# EAGLE design canSlaveV05b (EAGLE 6.5.0)

## Sheet 1 of 5
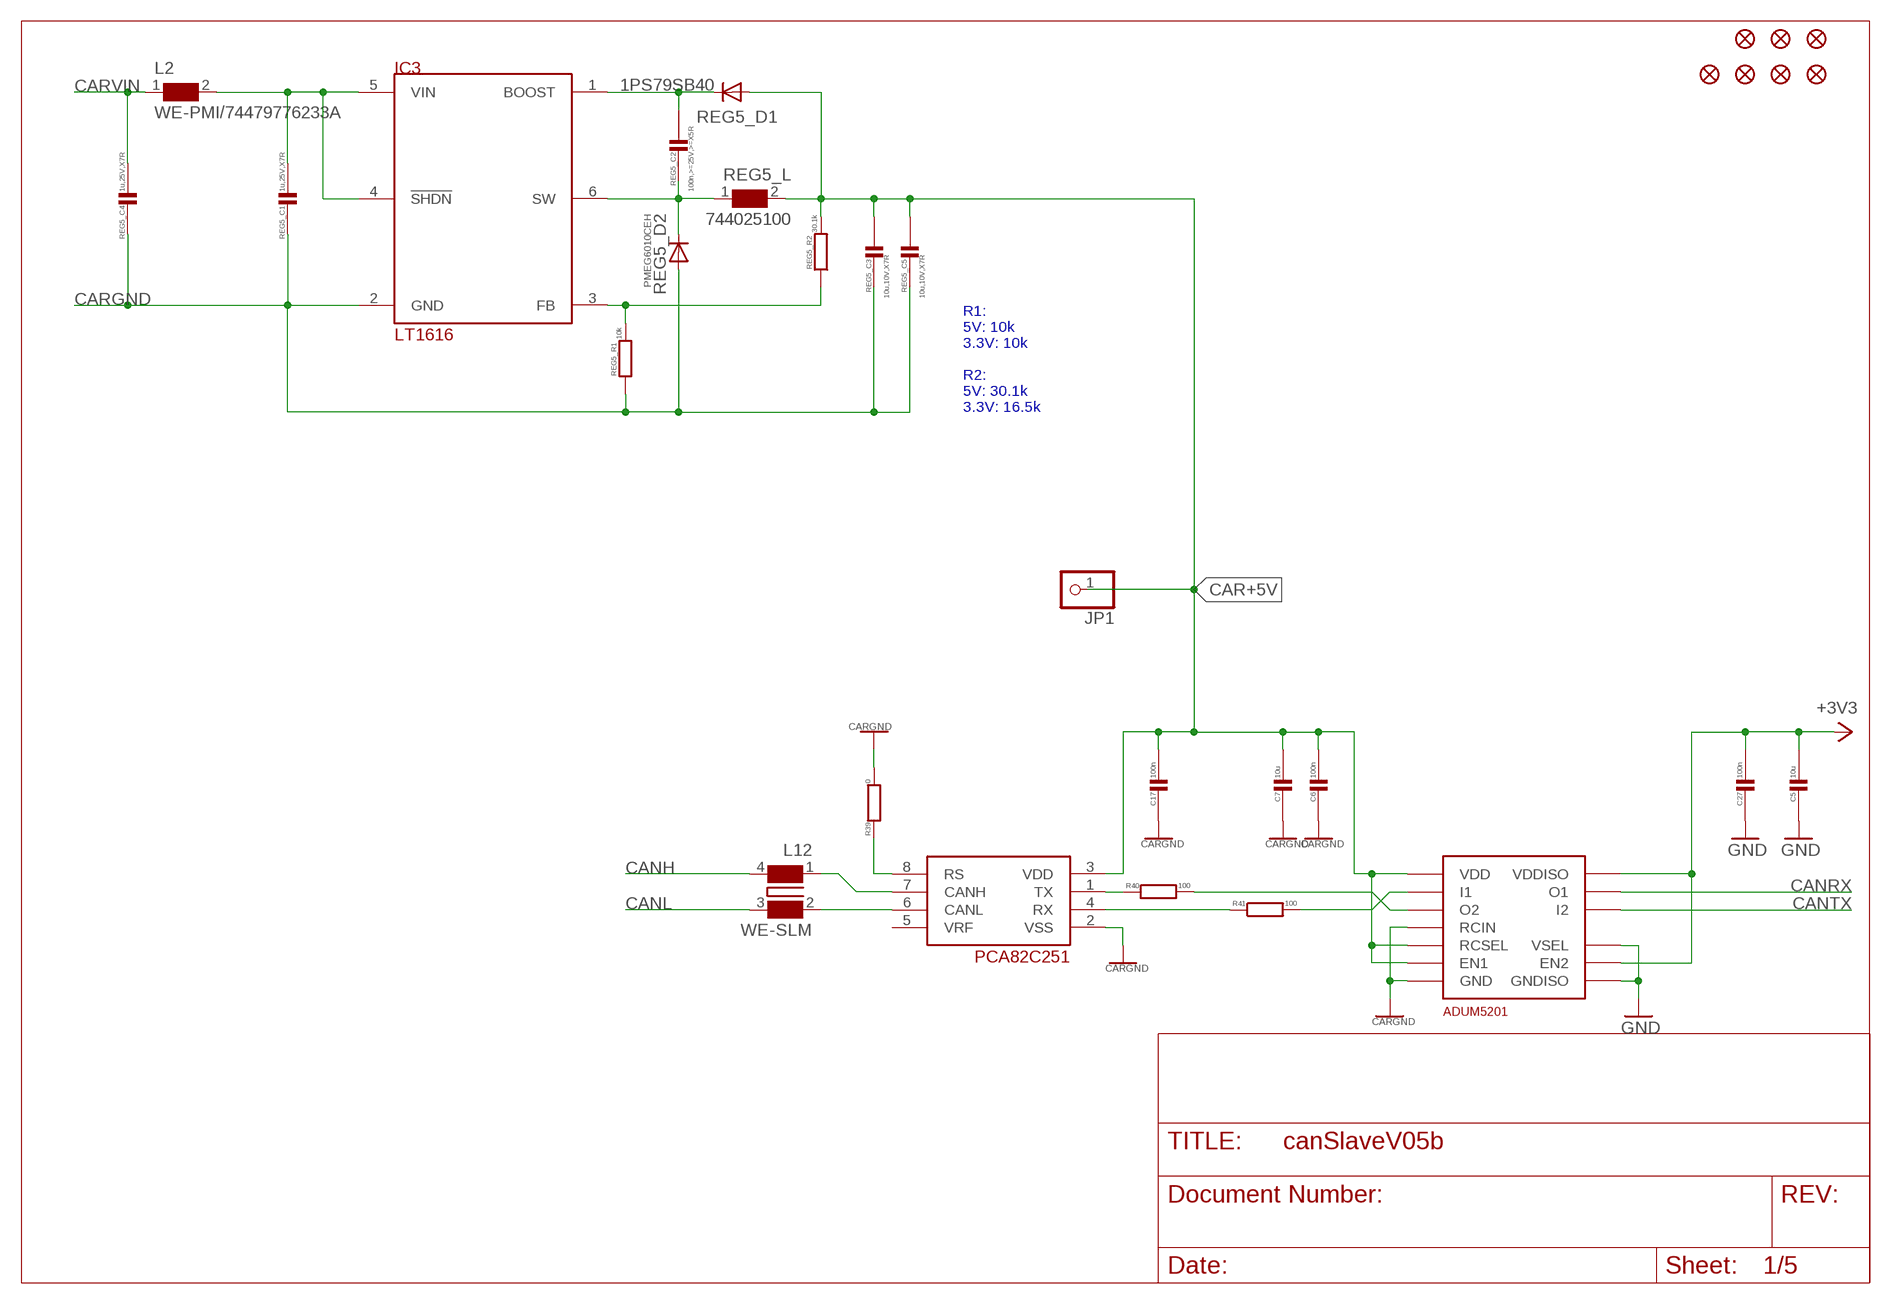
[diagram p0: schematic, sheet 1]

### Parts
C5  10u  C0603  [C0603]
C6  100n  C0402  [C0402]
C7  10u  C0603  [C0603]
C17  100n  C0402  [C0402]
C27  100n  C0402  [C0402]
FID2  FIDUCIAL""  [FIDUCIAL_1MM]
FID3  FIDUCIAL""  [FIDUCIAL_1MM]
FID4  FIDUCIAL""  [FIDUCIAL_1MM]
FID7  FIDUCIAL""  [FIDUCIAL_1MM]
FID8  FIDUCIAL""  [FIDUCIAL_1MM]
FID9  FIDUCIAL""  [FIDUCIAL_1MM]
FID10  FIDUCIAL""  [FIDUCIAL_1MM]
IC3  LT1616  [SOT23-6]
IC5  PCA82C251  MCP2551  [SO-8]
JP1  PINHD-1X1  [1X01]
L2  WE-PMI/74479776233A  WE-PMI_0806  [WE-PMI_0806]
L12  WE-SLM  [WE-SLM]
R39  0  R0402  [R0402]
R40  100  R0402  [R0402]
R41  100  R0402  [R0402]
REG5_C1  1u,25V,X7R  C0805  [C0805]
REG5_C2  100n,>=25V,>=X5R  C0402  [C0402]
REG5_C3  10u,10V,X7R  C0805  [C0805]
REG5_C4  1u,25V,X7R  C0805  [C0805]
REG5_C5  10u,10V,X7R  C0805  [C0805]
REG5_D1  1PS79SB40  DIODE-SOD523  [SOD523]
REG5_D2  PMEG6010CEH  D-SOD123  [SOD123]
REG5_L  744025100  WE-TPC_2828  [WE-TPC_2828]
REG5_R1  10k  R0402  [R0402]
REG5_R2  30.1k  R0402  [R0402]
U$2  ADUM5201  [SO16WB]

### Nets
+3V3: C5.1 C27.1 U$2.P$10(EN2) U$2.P$16(VDDISO) ; also sheet 2,3,5
BOOST1: IC3.1(BOOST) REG5_C2.1 REG5_D1.C
CANH: L12.4 ; also sheet 5
CANL: L12.3 ; also sheet 5
CANRX: U$2.P$14(O1) ; also sheet 2
CANTX: U$2.P$13(I2) ; also sheet 2
CAR+5V: C6.1 C7.1 C17.1 IC5.3(VDD) JP1.1 REG5_C3.1 REG5_C5.1 REG5_D1.A REG5_L.2 REG5_R2.2 U$2.P$1(VDD) U$2.P$6(RCSEL) U$2.P$7(EN1)
CAR_CANRX: R41.2 U$2.P$3(I1)
CAR_CANRX_T: IC5.4(RX) R41.1
CAR_CANTX: R40.2 U$2.P$4(O2)
CAR_CANTX_T: IC5.1(TX) R40.1
CARGND: C6.2 C7.2 C17.2 IC3.2(GND) IC5.2(VSS) R39.2 REG5_C1.2 REG5_C3.2 REG5_C4.2 REG5_C5.2 REG5_D2.2(A) REG5_R1.1 U$2.P$2(GND) U$2.P$5(RCIN) U$2.P$8(GND) ; also sheet 5
CARVIN: L2.1 REG5_C4.1 ; also sheet 5
CARVINFILT: IC3.4(!SHDN) IC3.5(VIN) L2.2 REG5_C1.1
FB1: IC3.3(FB) REG5_R1.2 REG5_R2.1
GND: C5.2 C27.2 U$2.P$9(GNDISO) U$2.P$11(VSEL) U$2.P$15(GNDISO) ; also sheet 2,3,5
N$2: IC5.7(CANH) L12.1
N$6: IC5.6(CANL) L12.2
RS1: IC5.8(RS) R39.1
SW1: IC3.6(SW) REG5_C2.2 REG5_D2.1(C) REG5_L.1
Unconnected: IC5.5(VRF)

### Notes on the sheet
- R1:
  5V: 10k
  3.3V: 10k
  
  R2:
  5V: 30.1k
  3.3V: 16.5k

## Sheet 2 of 5
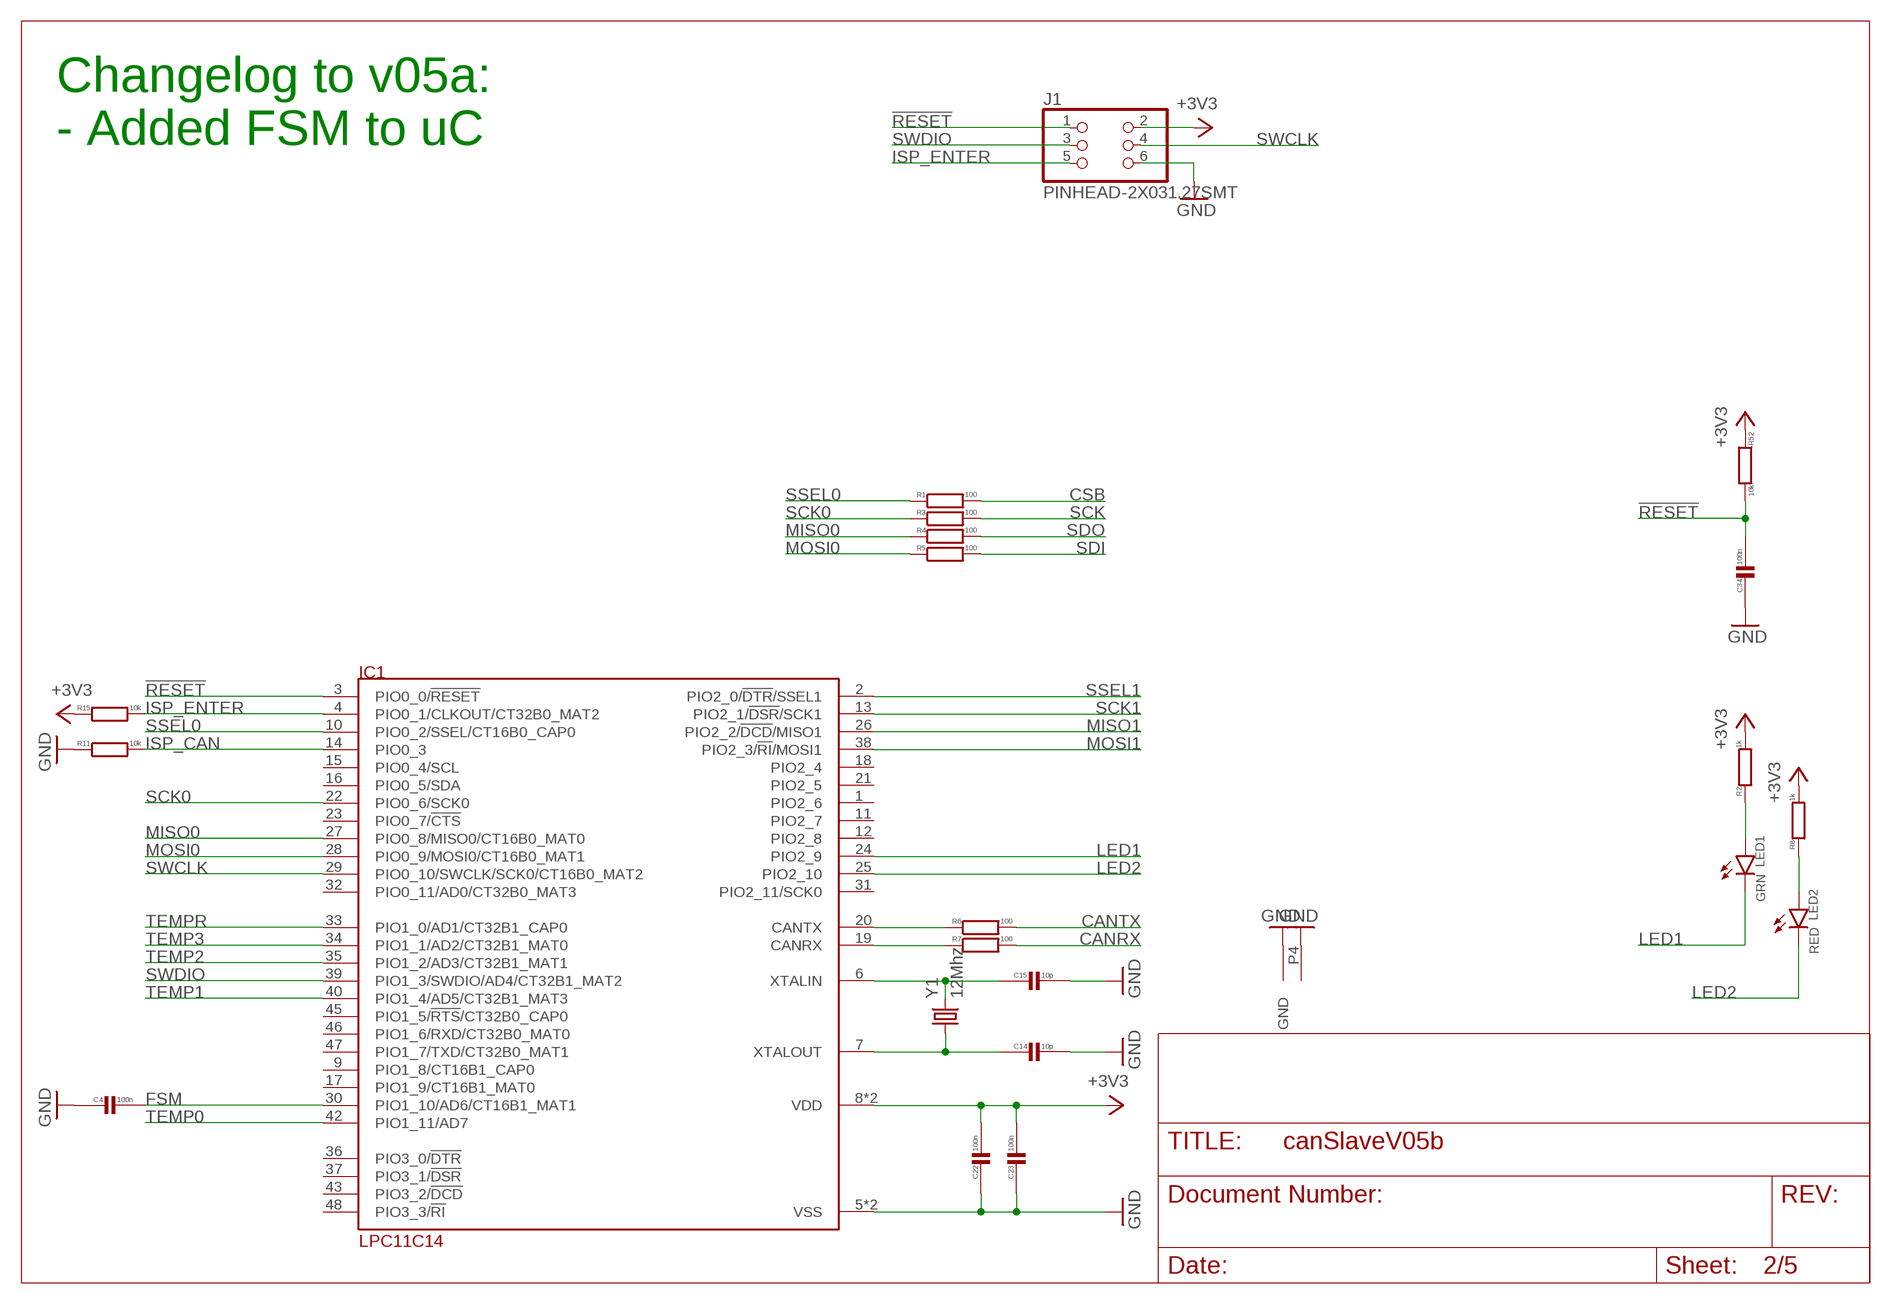
[diagram p1: schematic, sheet 2]

### Parts
C4  100n  C0402  [C0402]
C14  10p  C0402  [C0402]
C15  10p  C0402  [C0402]
C22  100n  C0402  [C0402]
C23  100n  C0402  [C0402]
C34  100n  C0402  [C0402]
IC1  LPC11C14  LPC11C1X  [LQFP48]
J1  PINHEAD-2X031.27SMT  [2X03_1.27MM_SMT]
LED1  GRN  LED0603  [CHIPLED_0603]
LED2  RED  LED0603  [CHIPLED_0603]
R1  100  R0402  [R0402]
R2  1k  R0402  [R0402]
R3  100  R0402  [R0402]
R4  100  R0402  [R0402]
R5  100  R0402  [R0402]
R6  100  R0402  [R0402]
R7  100  R0402  [R0402]
R8  1k  R0402  [R0402]
R11  10k  R0402  [R0402]
R15  10k  R0402  [R0402]
R52  10k  R0402  [R0402]
Y1  12Mhz  CRYSTAL43.2X2.5  [MT]

### Nets
!RESET: C34.1 IC1.3(PIO0_0/!RESET) J1.1 R52.2
+3V3: C22.1 C23.1 IC1.8(VDD) IC1.44(VDD) J1.2 R2.2 R8.2 R15.1 R52.1 ; also sheet 1,3,5
CANRX: R7.2 ; also sheet 1
CANRX_U_L: IC1.19(CANRX) R7.1
CANTX: R6.2 ; also sheet 1
CANTX_U_L: IC1.20(CANTX) R6.1
CSB: R1.2 ; also sheet 3
FSM: C4.1 IC1.30(PIO1_10/AD6/CT16B1_MAT1) ; also sheet 3
GND: C4.2 C14.1 C15.1 C22.2 C23.2 C34.2 IC1.5(VSS) IC1.41(VSS) J1.6 R11.1 Y1.P2(GND) Y1.P4(GND1) ; also sheet 1,3,5
ISP_CAN: IC1.14(PIO0_3) R11.2
ISP_ENTER: IC1.4(PIO0_1/CLKOUT/CT32B0_MAT2) J1.5 R15.2
LED1: IC1.24(PIO2_9) LED1.C
LED2: IC1.25(PIO2_10) LED2.C
MISO0: IC1.27(PIO0_8/MISO0/CT16B0_MAT0) R4.1
MISO1: IC1.26(PIO2_2/!DCD!/MISO1)
MOSI0: IC1.28(PIO0_9/MOSI0/CT16B0_MAT1) R5.1
MOSI1: IC1.38(PIO2_3/!RI!/MOSI1)
N$1: LED2.A R8.1
N$5: LED1.A R2.1
SCK: R3.2 ; also sheet 3
SCK0: IC1.22(PIO0_6/SCK0) R3.1
SCK1: IC1.13(PIO2_1/!DSR!/SCK1)
SDI: R5.2 ; also sheet 3
SDO: R4.2 ; also sheet 3
SSEL0: IC1.10(PIO0_2/SSEL/CT16B0_CAP0) R1.1
SSEL1: IC1.2(PIO2_0/!DTR!/SSEL1)
SWCLK: IC1.29(PIO0_10/SWCLK/SCK0/CT16B0_MAT2) J1.4
SWDIO: IC1.39(PIO1_3/SWDIO/AD4/CT32B1_MAT2) J1.3
TEMP0: IC1.42(PIO1_11/AD7) ; also sheet 5
TEMP1: IC1.40(PIO1_4/AD5/CT32B1_MAT3) ; also sheet 5
TEMP2: IC1.35(PIO1_2/AD3/CT32B1_MAT1) ; also sheet 5
TEMP3: IC1.34(PIO1_1/AD2/CT32B1_MAT0) ; also sheet 5
TEMPR: IC1.33(PIO1_0/AD1/CT32B1_CAP0) ; also sheet 3
XTALIN: C15.2 IC1.6(XTALIN) Y1.P3
XTALOUT: C14.2 IC1.7(XTALOUT) Y1.P1
Unconnected: IC1.1(PIO2_6) IC1.9(PIO1_8/CT16B1_CAP0) IC1.11(PIO2_7) IC1.12(PIO2_8) IC1.15(PIO0_4/SCL) IC1.16(PIO0_5/SDA) IC1.17(PIO1_9/CT16B1_MAT0) IC1.18(PIO2_4) IC1.21(PIO2_5) IC1.23(PIO0_7/!CTS) IC1.31(PIO2_11/SCK0) IC1.32(PIO0_11/AD0/CT32B0_MAT3) IC1.36(PIO3_0/!DTR) IC1.37(PIO3_1/!DSR) IC1.43(PIO3_2/!DCD) IC1.45(PIO1_5/!RTS!/CT32B0_CAP0) IC1.46(PIO1_6/RXD/CT32B0_MAT0) IC1.47(PIO1_7/TXD/CT32B0_MAT1) IC1.48(PIO3_3/!RI)

### Notes on the sheet
- Changelog to v05a:
  - Added FSM to uC

## Sheet 3 of 5
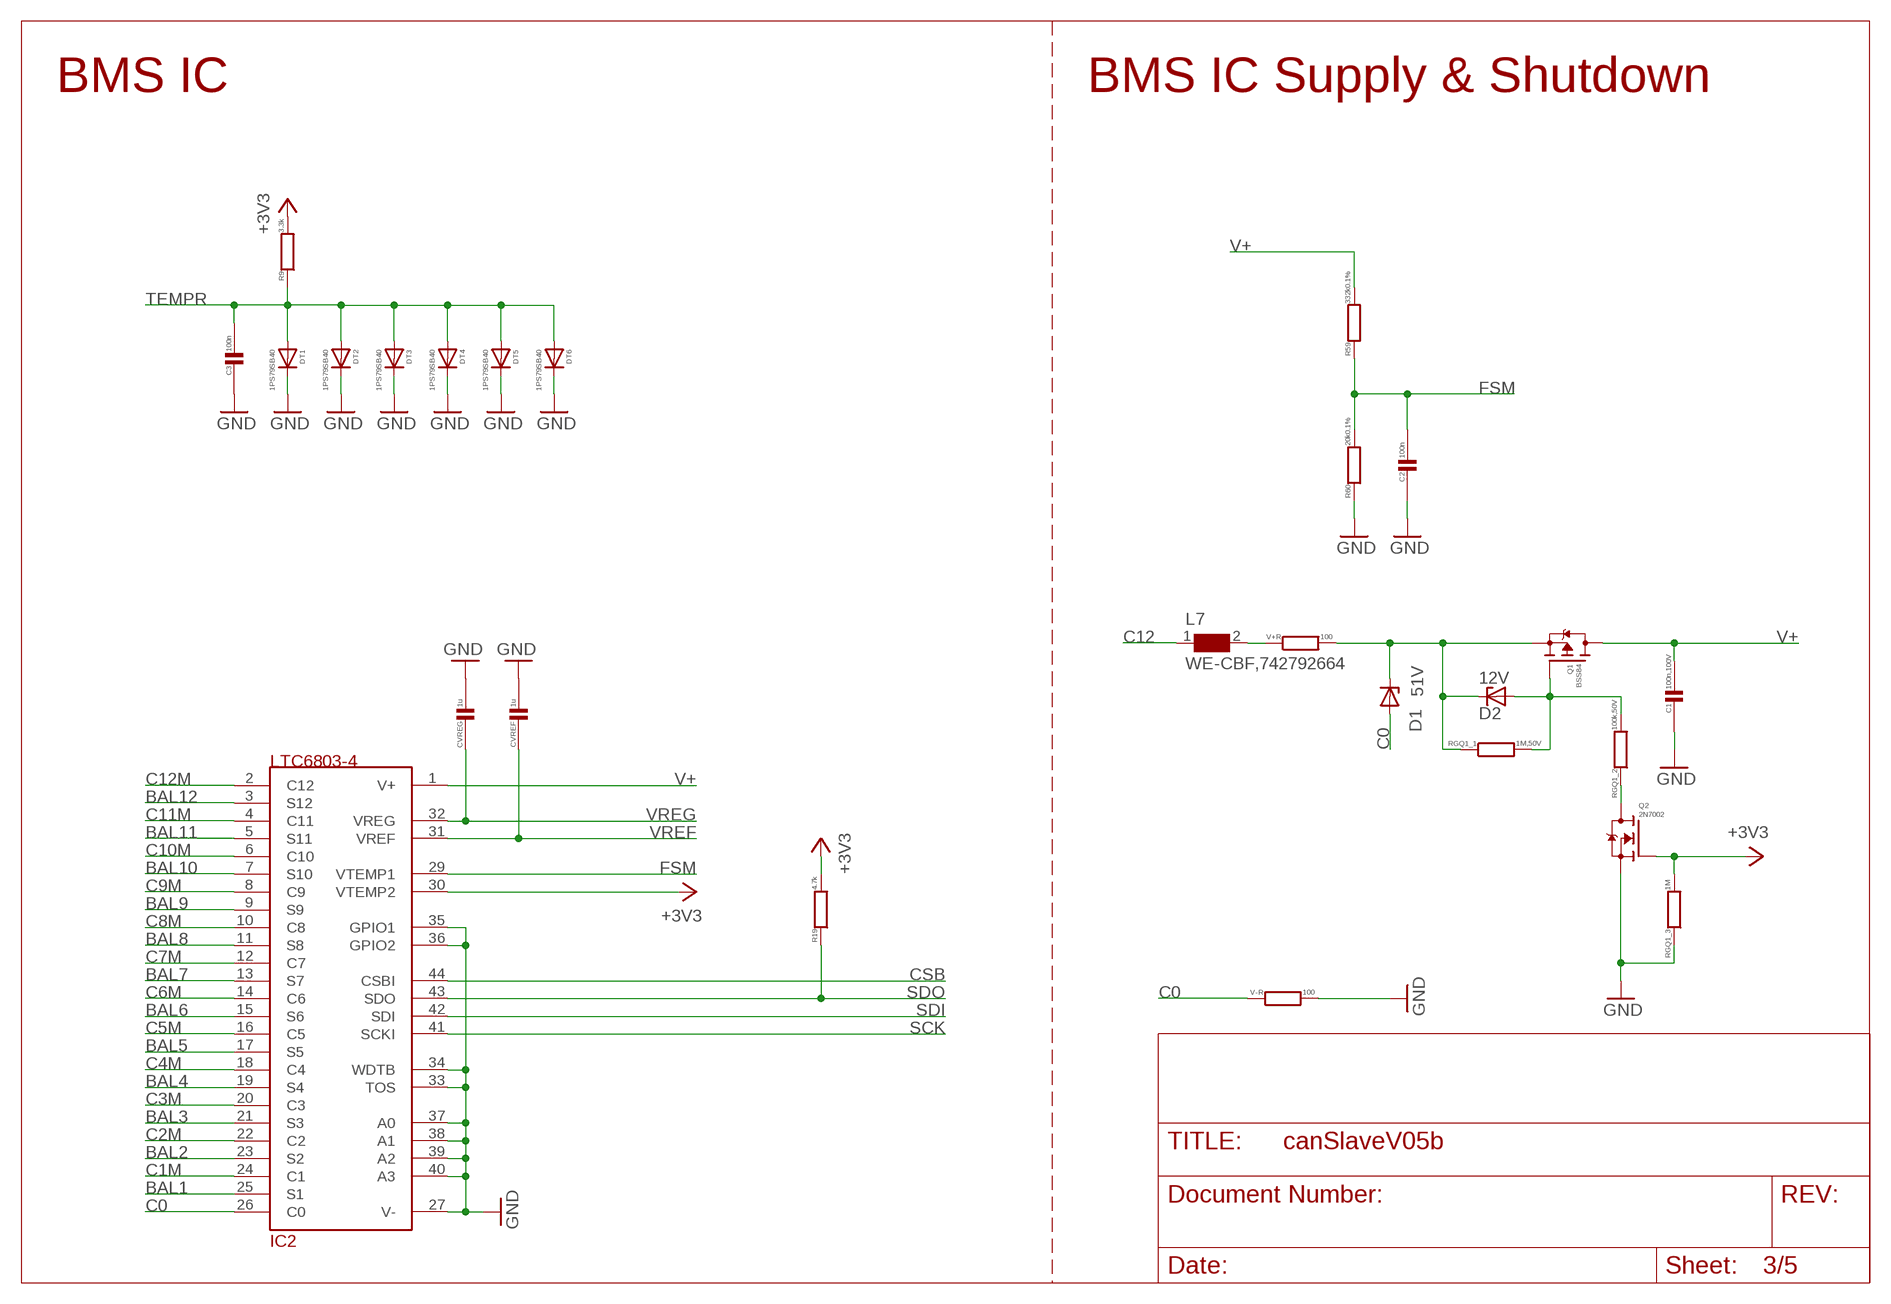
[diagram p2: schematic, sheet 3]

### Parts
C1  100n,100V  C0603  [C0603]
C2  100n  C0402  [C0402]
C3  100n  C0402  [C0402]
CVREF  1u  C0402  [C0402]
CVREG  1u  C0402  [C0402]
D1  51V  ZENERSOD323  [SOD323-L]
D2  12V  ZENERSOD323  [SOD323-L]
DT1  1PS79SB40  DIODE-SOD523  [SOD523]
DT2  1PS79SB40  DIODE-SOD523  [SOD523]
DT3  1PS79SB40  DIODE-SOD523  [SOD523]
DT4  1PS79SB40  DIODE-SOD523  [SOD523]
DT5  1PS79SB40  DIODE-SOD523  [SOD523]
DT6  1PS79SB40  DIODE-SOD523  [SOD523]
IC2  LTC6803-4  [44SSOP]
L7  WE-CBF,742792664  WE-CBF_0603  [0603]
Q1  BSS84  [SOT23]
Q2  2N7002  [SOT23]
R9  3.3k  R0603  [R0603]
R19  4.7k  R0402  [R0402]
R59  332k0.1%  R0603  [R0603]
R60  20k0.1%  R0402  [R0402]
RGQ1_1  1M,50V  R0603  [R0603]
RGQ1_2  100k,50V  R0603  [R0603]
RGQ1_3  1M  R0402  [R0402]
V+R  100  R0603  [R0603]
V-R  100  R0603  [R0603]

### Nets
+3V3: IC2.30(VTEMP2) Q2.1(G) R9.2 R19.2 RGQ1_3.2 ; also sheet 1,2,5
BAL1: IC2.25(S1) ; also sheet 4
BAL2: IC2.23(S2) ; also sheet 4
BAL3: IC2.21(S3) ; also sheet 4
BAL4: IC2.19(S4) ; also sheet 4
BAL5: IC2.17(S5) ; also sheet 4
BAL6: IC2.15(S6) ; also sheet 4
BAL7: IC2.13(S7) ; also sheet 4
BAL8: IC2.11(S8) ; also sheet 4
BAL9: IC2.9(S9) ; also sheet 4
BAL10: IC2.7(S10) ; also sheet 4
BAL11: IC2.5(S11) ; also sheet 4
BAL12: IC2.3(S12) ; also sheet 4
C0: D1.A IC2.26(C0) V-R.1 ; also sheet 4,5
C1M: IC2.24(C1) ; also sheet 4
C2M: IC2.22(C2) ; also sheet 4
C3M: IC2.20(C3) ; also sheet 4
C4M: IC2.18(C4) ; also sheet 4
C5M: IC2.16(C5) ; also sheet 4
C6M: IC2.14(C6) ; also sheet 4
C7M: IC2.12(C7) ; also sheet 4
C8M: IC2.10(C8) ; also sheet 4
C9M: IC2.8(C9) ; also sheet 4
C10M: IC2.6(C10) ; also sheet 4
C11M: IC2.4(C11) ; also sheet 4
C12: L7.1 ; also sheet 4,5
C12M: IC2.2(C12) ; also sheet 4
CSB: IC2.44(CSBI) ; also sheet 2
FSM: C2.1 IC2.29(VTEMP1) R59.1 R60.2 ; also sheet 2
GND: C1.2 C2.2 C3.2 CVREF.1 CVREG.1 DT1.C DT2.C DT3.C DT4.C DT5.C DT6.C IC2.27(V-) IC2.33(TOS) IC2.34(WDTB) IC2.35(GPIO1) IC2.36(GPIO2) IC2.37(A0) IC2.38(A1) IC2.39(A2) IC2.40(A3) Q2.2(S) R60.1 RGQ1_3.1 V-R.2 ; also sheet 1,2,5
N$3: Q2.3(D) RGQ1_2.1
N$4: L7.2 V+R.1
Q1G: D2.A Q1.1(G) RGQ1_1.2 RGQ1_2.2
SCK: IC2.41(SCKI) ; also sheet 2
SDI: IC2.42(SDI) ; also sheet 2
SDO: IC2.43(SDO) R19.1 ; also sheet 2
TEMPR: C3.1 DT1.A DT2.A DT3.A DT4.A DT5.A DT6.A R9.1 ; also sheet 2
V+: C1.1 IC2.1(V+) Q1.3(D) R59.2
V+S: D1.C D2.C Q1.2(S) RGQ1_1.1 V+R.2
VREF: CVREF.2 IC2.31(VREF)
VREG: CVREG.2 IC2.32(VREG)

### Notes on the sheet
- BMS IC | BMS IC Supply & Shutdown

## Sheet 4 of 5
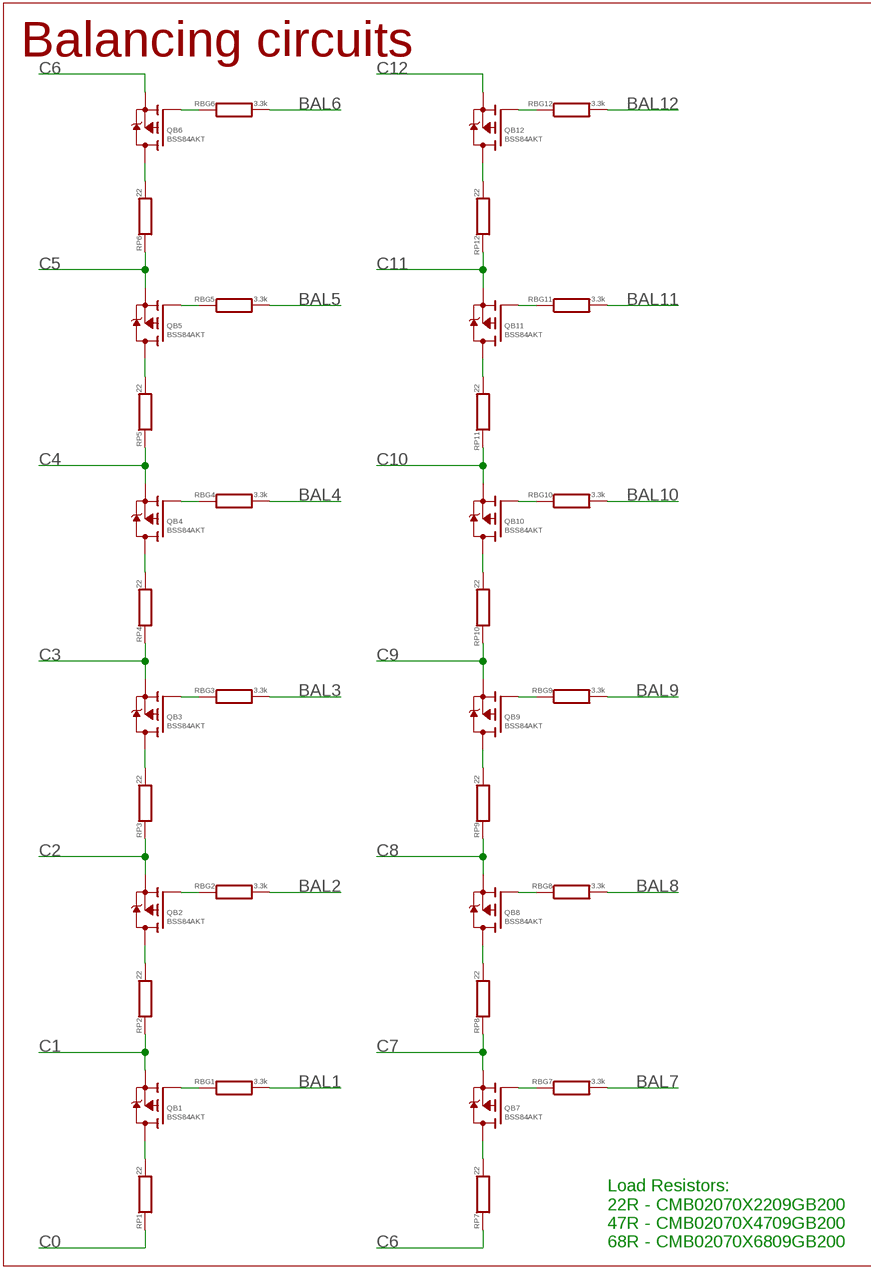
[diagram p3: schematic, sheet 4, part 1 of 2]
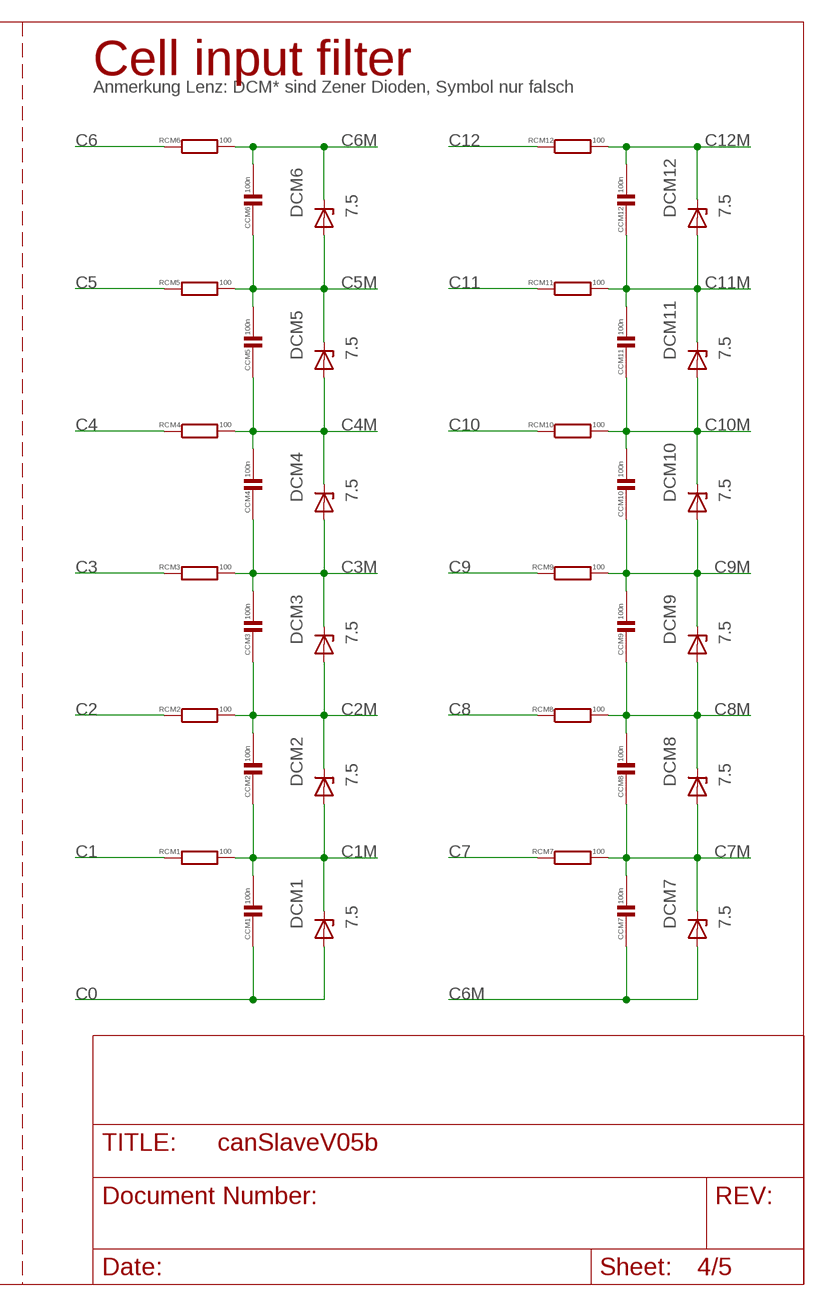
[diagram p4: schematic, sheet 4, part 2 of 2]

### Parts
CCM1  100n  C0402  [C0402]
CCM2  100n  C0402  [C0402]
CCM3  100n  C0402  [C0402]
CCM4  100n  C0402  [C0402]
CCM5  100n  C0402  [C0402]
CCM6  100n  C0402  [C0402]
CCM7  100n  C0402  [C0402]
CCM8  100n  C0402  [C0402]
CCM9  100n  C0402  [C0402]
CCM10  100n  C0402  [C0402]
CCM11  100n  C0402  [C0402]
CCM12  100n  C0402  [C0402]
DCM1  7.5  ZENERSOD523  [SOD523]
DCM2  7.5  ZENERSOD523  [SOD523]
DCM3  7.5  ZENERSOD523  [SOD523]
DCM4  7.5  ZENERSOD523  [SOD523]
DCM5  7.5  ZENERSOD523  [SOD523]
DCM6  7.5  ZENERSOD523  [SOD523]
DCM7  7.5  ZENERSOD523  [SOD523]
DCM8  7.5  ZENERSOD523  [SOD523]
DCM9  7.5  ZENERSOD523  [SOD523]
DCM10  7.5  ZENERSOD523  [SOD523]
DCM11  7.5  ZENERSOD523  [SOD523]
DCM12  7.5  ZENERSOD523  [SOD523]
QB1  BSS84AKT  [SOT416]
QB2  BSS84AKT  [SOT416]
QB3  BSS84AKT  [SOT416]
QB4  BSS84AKT  [SOT416]
QB5  BSS84AKT  [SOT416]
QB6  BSS84AKT  [SOT416]
QB7  BSS84AKT  [SOT416]
QB8  BSS84AKT  [SOT416]
QB9  BSS84AKT  [SOT416]
QB10  BSS84AKT  [SOT416]
QB11  BSS84AKT  [SOT416]
QB12  BSS84AKT  [SOT416]
RBG1  3.3k  R0402  [R0402]
RBG2  3.3k  R0402  [R0402]
RBG3  3.3k  R0402  [R0402]
RBG4  3.3k  R0402  [R0402]
RBG5  3.3k  R0402  [R0402]
RBG6  3.3k  R0402  [R0402]
RBG7  3.3k  R0402  [R0402]
RBG8  3.3k  R0402  [R0402]
RBG9  3.3k  R0402  [R0402]
RBG10  3.3k  R0402  [R0402]
RBG11  3.3k  R0402  [R0402]
RBG12  3.3k  R0402  [R0402]
RCM1  100  R0402  [R0402]
RCM2  100  R0402  [R0402]
RCM3  100  R0402  [R0402]
RCM4  100  R0402  [R0402]
RCM5  100  R0402  [R0402]
RCM6  100  R0402  [R0402]
RCM7  100  R0402  [R0402]
RCM8  100  R0402  [R0402]
RCM9  100  R0402  [R0402]
RCM10  100  R0402  [R0402]
RCM11  100  R0402  [R0402]
RCM12  100  R0402  [R0402]
RP1  22  RMELF-0207R  [MINI_MELF-0207R]
RP2  22  RMELF-0207R  [MINI_MELF-0207R]
RP3  22  RMELF-0207R  [MINI_MELF-0207R]
RP4  22  RMELF-0207R  [MINI_MELF-0207R]
RP5  22  RMELF-0207R  [MINI_MELF-0207R]
RP6  22  RMELF-0207R  [MINI_MELF-0207R]
RP7  22  RMELF-0207R  [MINI_MELF-0207R]
RP8  22  RMELF-0207R  [MINI_MELF-0207R]
RP9  22  RMELF-0207R  [MINI_MELF-0207R]
RP10  22  RMELF-0207R  [MINI_MELF-0207R]
RP11  22  RMELF-0207R  [MINI_MELF-0207R]
RP12  22  RMELF-0207R  [MINI_MELF-0207R]

### Nets
BAL1: RBG1.2 ; also sheet 3
BAL2: RBG2.2 ; also sheet 3
BAL3: RBG3.2 ; also sheet 3
BAL4: RBG4.2 ; also sheet 3
BAL5: RBG5.2 ; also sheet 3
BAL6: RBG6.2 ; also sheet 3
BAL7: RBG7.2 ; also sheet 3
BAL8: RBG8.2 ; also sheet 3
BAL9: RBG9.2 ; also sheet 3
BAL10: RBG10.2 ; also sheet 3
BAL11: RBG11.2 ; also sheet 3
BAL12: RBG12.2 ; also sheet 3
C0: CCM1.2 DCM1.A RP1.1 ; also sheet 3,5
C1: QB1.2(S) RCM1.1 RP2.1 ; also sheet 5
C1M: CCM1.1 CCM2.2 DCM1.C DCM2.A RCM1.2 ; also sheet 3
C2: QB2.2(S) RCM2.1 RP3.1 ; also sheet 5
C2M: CCM2.1 CCM3.2 DCM2.C DCM3.A RCM2.2 ; also sheet 3
C3: QB3.2(S) RCM3.1 RP4.1 ; also sheet 5
C3M: CCM3.1 CCM4.2 DCM3.C DCM4.A RCM3.2 ; also sheet 3
C4: QB4.2(S) RCM4.1 RP5.1 ; also sheet 5
C4M: CCM4.1 CCM5.2 DCM4.C DCM5.A RCM4.2 ; also sheet 3
C5: QB5.2(S) RCM5.1 RP6.1 ; also sheet 5
C5M: CCM5.1 CCM6.2 DCM5.C DCM6.A RCM5.2 ; also sheet 3
C6: QB6.2(S) RCM6.1 RP7.1 ; also sheet 5
C6M: CCM6.1 CCM7.2 DCM6.C DCM7.A RCM6.2 ; also sheet 3
C7: QB7.2(S) RCM7.1 RP8.1 ; also sheet 5
C7M: CCM7.1 CCM8.2 DCM7.C DCM8.A RCM7.2 ; also sheet 3
C8: QB8.2(S) RCM8.1 RP9.1 ; also sheet 5
C8M: CCM8.1 CCM9.2 DCM8.C DCM9.A RCM8.2 ; also sheet 3
C9: QB9.2(S) RCM9.1 RP10.1 ; also sheet 5
C9M: CCM9.1 CCM10.2 DCM9.C DCM10.A RCM9.2 ; also sheet 3
C10: QB10.2(S) RCM10.1 RP11.1 ; also sheet 5
C10M: CCM10.1 CCM11.2 DCM10.C DCM11.A RCM10.2 ; also sheet 3
C11: QB11.2(S) RCM11.1 RP12.1 ; also sheet 5
C11M: CCM11.1 CCM12.2 DCM11.C DCM12.A RCM11.2 ; also sheet 3
C12: QB12.2(S) RCM12.1 ; also sheet 3,5
C12M: CCM12.1 DCM12.C RCM12.2 ; also sheet 3
CR1: QB1.3(D) RP1.2
CR2: QB2.3(D) RP2.2
CR3: QB3.3(D) RP3.2
CR4: QB4.3(D) RP4.2
CR5: QB5.3(D) RP5.2
CR6: QB6.3(D) RP6.2
CR7: QB7.3(D) RP7.2
CR8: QB8.3(D) RP8.2
CR9: QB9.3(D) RP9.2
CR10: QB10.3(D) RP10.2
CR11: QB11.3(D) RP11.2
CR12: QB12.3(D) RP12.2
QBG1: QB1.1(G) RBG1.1
QBG2: QB2.1(G) RBG2.1
QBG3: QB3.1(G) RBG3.1
QBG4: QB4.1(G) RBG4.1
QBG5: QB5.1(G) RBG5.1
QBG6: QB6.1(G) RBG6.1
QBG7: QB7.1(G) RBG7.1
QBG8: QB8.1(G) RBG8.1
QBG9: QB9.1(G) RBG9.1
QBG10: QB10.1(G) RBG10.1
QBG11: QB11.1(G) RBG11.1
QBG12: QB12.1(G) RBG12.1

### Notes on the sheet
- Balancing circuits | Cell input filter
- Anmerkung Lenz: DCM* sind Zener Dioden, Symbol nur falsch
- Load Resistors:
  22R - CMB02070X2209GB200 
  47R - CMB02070X4709GB200 
  68R - CMB02070X6809GB200

## Sheet 5 of 5
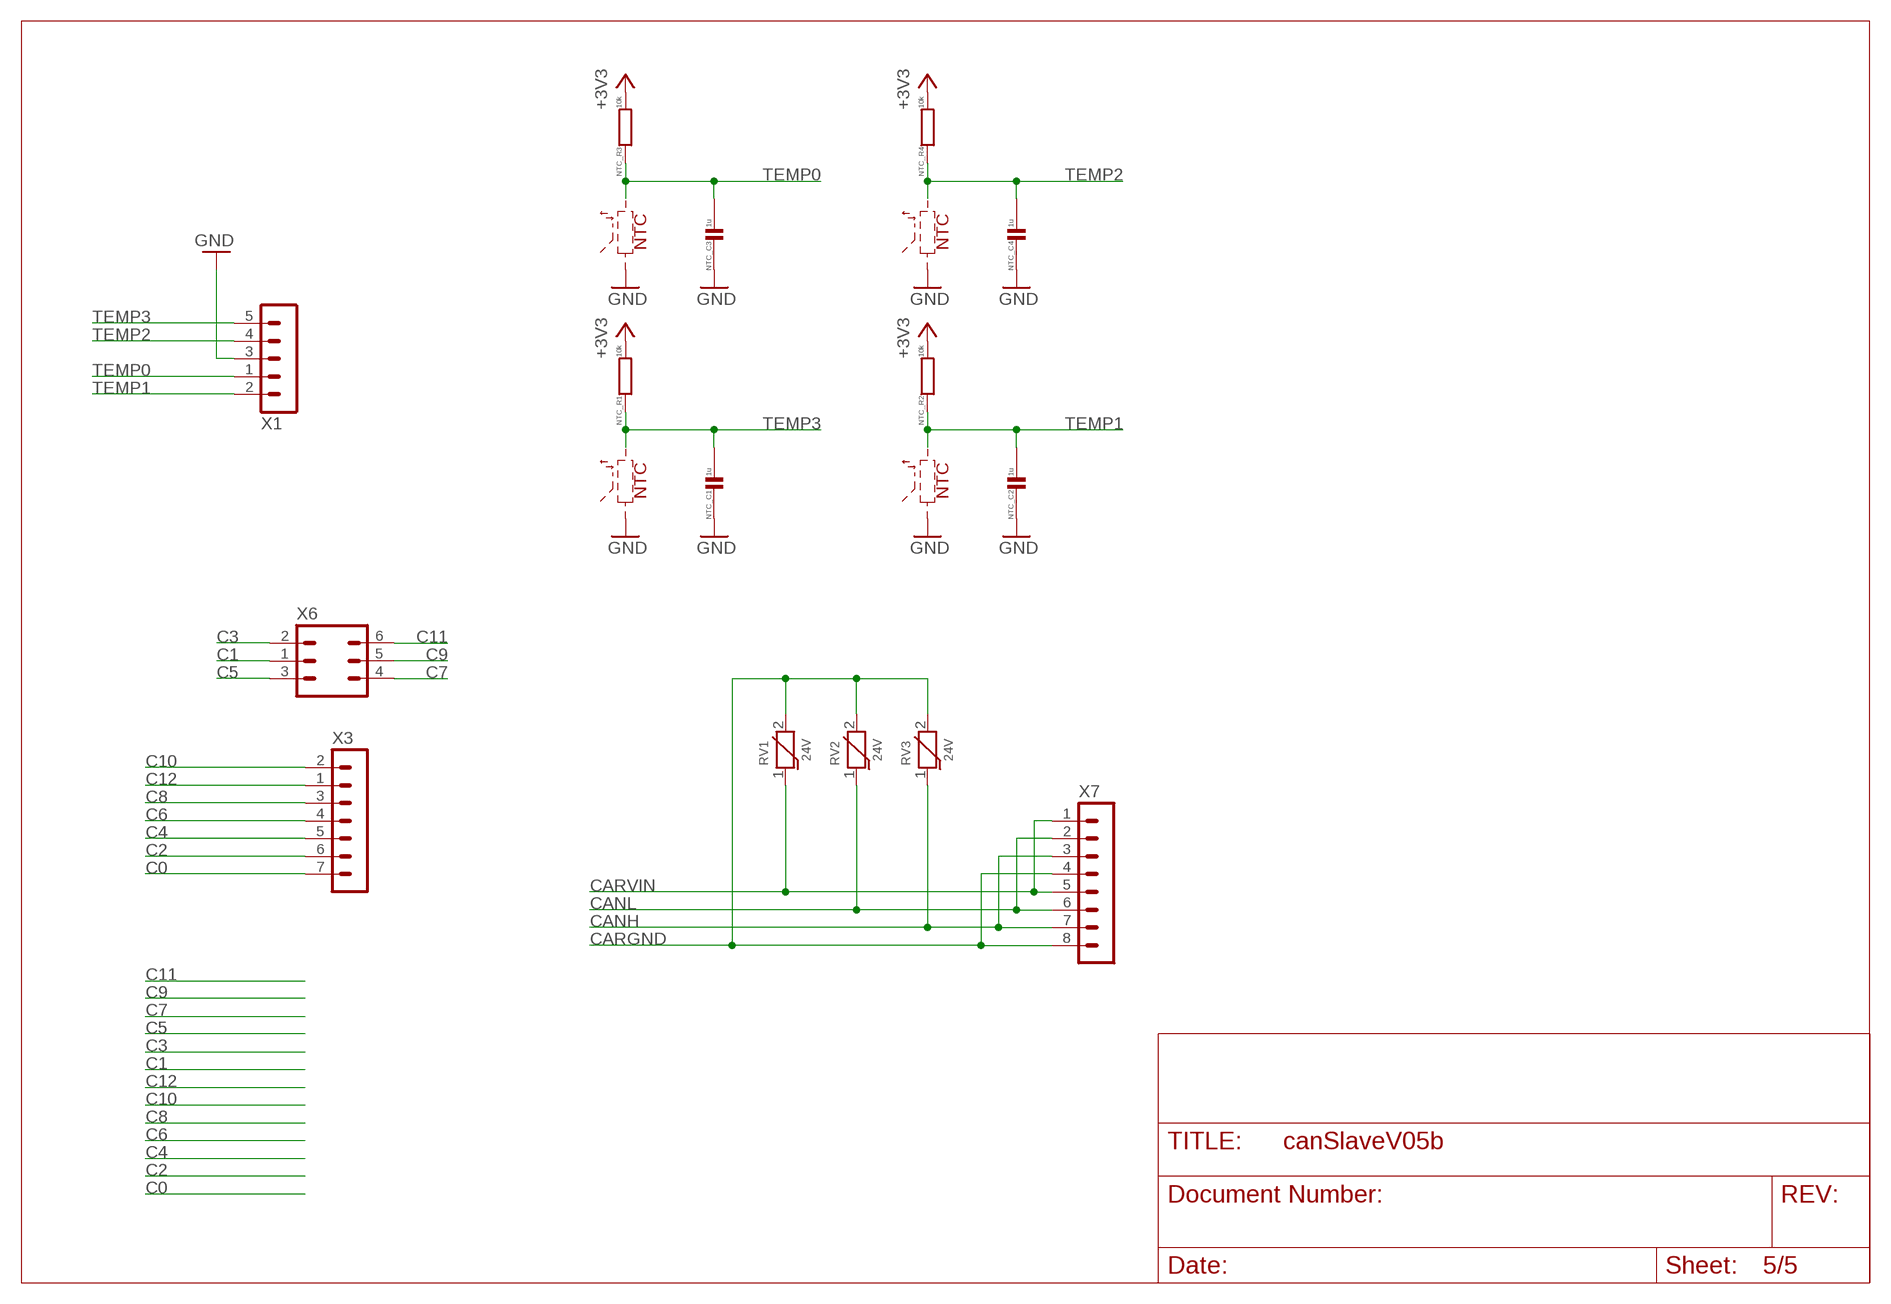
[diagram p5: schematic, sheet 5]

### Parts
NTC_C1  1u  C0402  [C0402]
NTC_C2  1u  C0402  [C0402]
NTC_C3  1u  C0402  [C0402]
NTC_C4  1u  C0402  [C0402]
NTC_R1  10k  R0402  [R0402]
NTC_R2  10k  R0402  [R0402]
NTC_R3  10k  R0402  [R0402]
NTC_R4  10k  R0402  [R0402]
RV1  24V  VARISTOR0805  [R0805]
RV2  24V  VARISTOR0603  [R0603]
RV3  24V  VARISTOR0603  [R0603]
X1  HEADER_POS5_43650-0509  [43650-0509]
X3  HEADER_POS7_43650-0709  [43650-0709]
X6  HEADER_POS6_43650-0609  [43650-0609]
X7  HEADER_POS8_43045-0800  [43045-0800]

### Nets
+3V3: NTC_R1.2 NTC_R2.2 NTC_R3.2 NTC_R4.2 ; also sheet 1,2,3
C0: X3.7 ; also sheet 3,4
C1: X6.1 ; also sheet 4
C2: X3.6 ; also sheet 4
C3: X6.2 ; also sheet 4
C4: X3.5 ; also sheet 4
C5: X6.3 ; also sheet 4
C6: X3.4 ; also sheet 4
C7: X6.4 ; also sheet 4
C8: X3.3 ; also sheet 4
C9: X6.5 ; also sheet 4
C10: X3.2 ; also sheet 4
C11: X6.6 ; also sheet 4
C12: X3.1 ; also sheet 3,4
CANH: RV3.1 X7.3 X7.7 ; also sheet 1
CANL: RV2.1 X7.2 X7.6 ; also sheet 1
CARGND: RV1.2 RV2.2 RV3.2 X7.4 X7.8 ; also sheet 1
CARVIN: RV1.1 X7.1 X7.5 ; also sheet 1
GND: NTC_C1.2 NTC_C2.2 NTC_C3.2 NTC_C4.2 X1.3 ; also sheet 1,2,3
TEMP0: NTC_C3.1 NTC_R3.1 X1.1 ; also sheet 2
TEMP1: NTC_C2.1 NTC_R2.1 X1.2 ; also sheet 2
TEMP2: NTC_C4.1 NTC_R4.1 X1.4 ; also sheet 2
TEMP3: NTC_C1.1 NTC_R1.1 X1.5 ; also sheet 2

### Notes on the sheet
- NTC | NTC
- NTC | NTC

## Library data of the parts
C1-C7 C14 C15 C17 C22 C23 C27 C34 CCM1-CCM12 CVREF CVREG NTC_C1-NTC_C4 REG5_C1-REG5_C5 = phrenetic:C
D1 D2 DCM1-DCM12 = phrenetic:ZENER
DT1-DT6 REG5_D1 = phrenetic:DIODE-: DIODE
FID2-FID4 FID7-FID10 = microbuilder:FIDUCIAL: Fiducial Alignment Points Various fiducial points for machine vision alignment.
IC1 = phrenetic:LPC11C1X
IC2 = bms-hsrm:LTC6803-4
IC3 = phrenetic:LT1616
IC5 = bms-hsrm:MCP2551
J1 = phrenetic:PINHEAD-2X03
JP1 = pinhead:PINHD-1X1: PIN HEADER
L2 = EagleLibrary_Wuerth_Elektronik_eiSos_Version_6:WE-PMI: Power Multilayer Inductor WE-PMI - Compact multilayer type - Suitable for applocations with high currents up to 2.5 A - No crosstalk -- DC / DC converters especially at high switching frequencies -- Portable devices like PDA and digital cameras
L7 = EagleLibrary_Wuerth_Elektronik_eiSos_Version_6:WE-CBF: SMD EMI Suppression Ferrite Beads WE-CBF - Excellent anti-EMI properties - Low DC-restistance - Impedances till 3000 ohms - Rated current up to 6 A -- Reliable Ni-Sn electrodes -- Perfect as data lined filter and for uncoupling of distribution voltage
L12 = EagleLibrary_Wuerth_Elektronik_eiSos_Version_6:WE-SLM: SMD Common Mode Line Filter WE-SLM - Small size - Low Profile - High Impedance - High current capability up to 300 mA -- USB -- CAN -- Firewire -- Data Lines -- Power supply systems -- Signal Lines
LED1 LED2 = phrenetic:LED
NTC_R1-NTC_R4 R1-R9 R11 R15 R19 R39-R41 R52 R59 R60 RBG1-RBG12 RCM1-RCM12 REG5_R1 REG5_R2 RGQ1_1-RGQ1_3 RP1-RP12 V+R V-R = phrenetic:R: RESISTOR, Bla
Q1 QB1-QB12 = phrenetic:BSS84
Q2 = phrenetic:2N7002
REG5_D2 = semicon-smd-ipc:D-: DIODE unfilled
REG5_L = EagleLibrary_Wuerth_Elektronik_eiSos_Version_6:WE-TPC: Shielded Tiny Power Inductor WE-TPC - Extremely flat power inductor - High current capability - High reliability and perfect soldering characteristics because of integrated soldering pad - magnetically shielded -- Portable power like PDA, digital camera, PCMICA-cards and displays -- DC/DC-converter -- Recommended for switching regulator IC's from Linear Technology, National Semiconductor, Texas Instruments and Fairchild Semiconductor
RV1-RV3 = phrenetic:VARISTOR
U$2 = phrenetic:ADUM5201
X1 = con-molex-micro-fit-3_0:HEADER_POS5_?: Molex - Micro-Fit 3.0 Series connector, 3.00mm (0.118") pitch header, 5 positions.
X3 = con-molex-micro-fit-3_0:HEADER_POS7_?: Molex - Micro-Fit 3.0 Series connector, 3.00mm (0.118") pitch header, 7 positions.
X6 = con-molex-micro-fit-3_0:HEADER_POS6_?: Molex - Micro-Fit 3.0 Series connector, 3.00mm (0.118") pitch header, 6 positions.
X7 = con-molex-micro-fit-3_0:HEADER_POS8_?: Molex - Micro-Fit 3.0 Series connector, 3.00mm (0.118") pitch header, 8 positions.
Y1 = phrenetic:CRYSTAL4

## Board
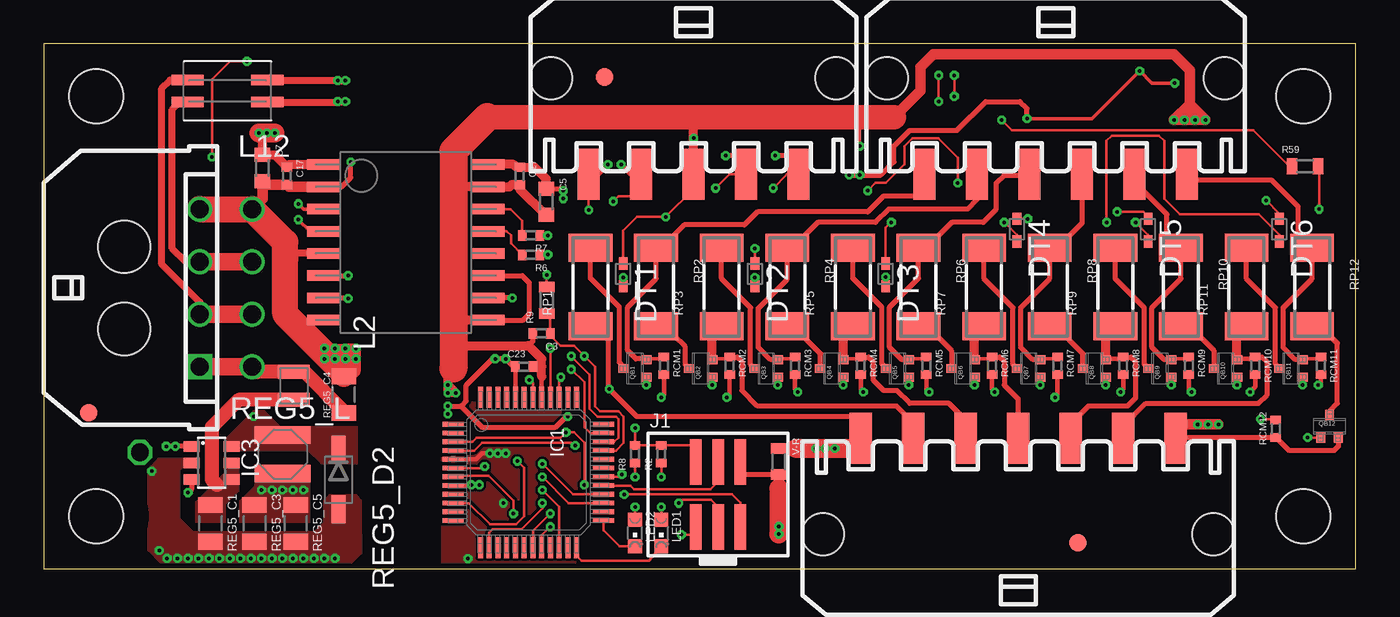
[diagram p6: board, top side]
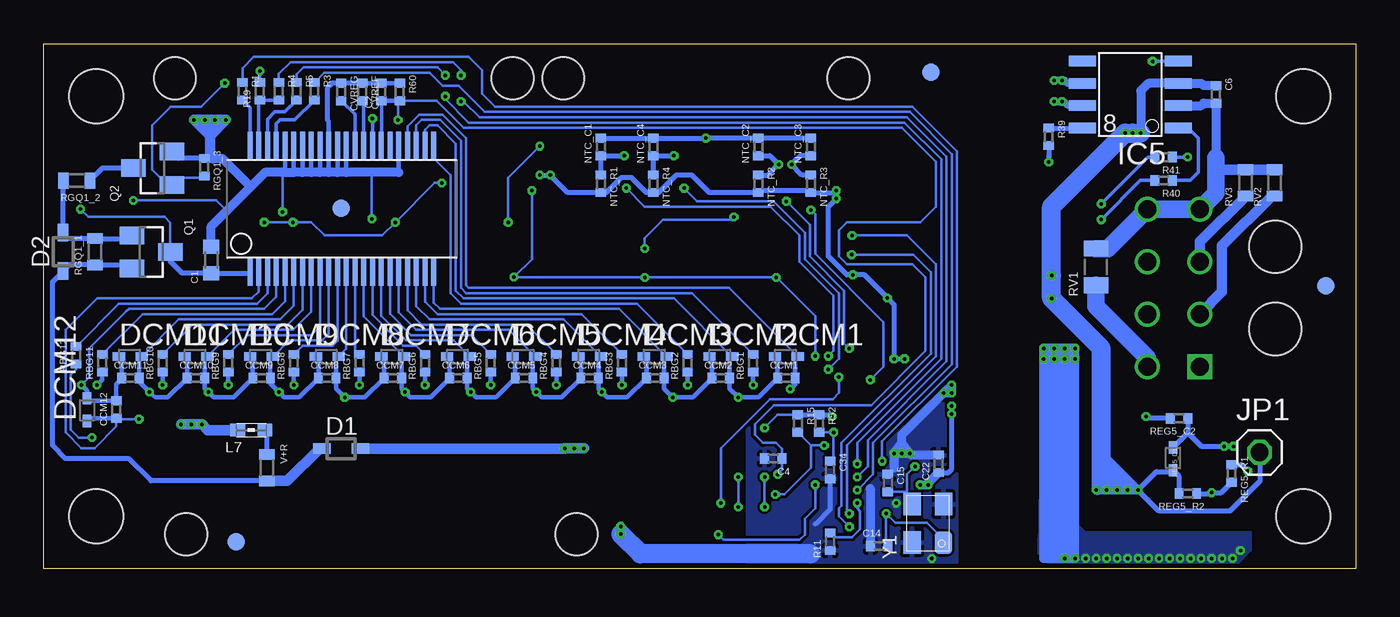
[diagram p7: board, bottom side, seen from below]

Size 75 x 30 mm. Coordinates in mm from the lower left corner, seen from the top.
Outline: 75,0 75,30 0,30 0,0 75,0
Copper layers (1*16): Top 0.035mm / dielectric 1.5mm / Bottom 0.035mm
Design rules "PCB-POOL Standard *": minimum track width 0.15mm, minimum drill 0.2mm, track to track 0.15mm, track to pad 0.15mm, pad to pad 0.15mm, via to via 0.15mm, smd to smd 0mil, copper to edge 0.3mm, drill to drill 0.2mm, minimum pad ring 0.2mm, minimum via ring 0.15mm, stop-mask expansion 0.075mm, vias tented up to drill 0.31mm, thermal gap 0.2mm
Holes 3.1 mm at 3,3 3,27 72,3 72,27
tRestrict: area 0,0 to 6,6; area 0,24 to 6,30; area 69,0 to 75,6; area 69,24 to 75,30; 1 lines
bRestrict: area 0,0 to 6,6; area 0,24 to 6,30; area 69,0 to 75,6; area 69,24 to 75,30; 1 lines

### Footprints (pad centres in the part's own frame; a part is rotated, then mirrored left to right if it is on the bottom)
C0603 = smd 0.8 x 0.9: 1 -0.75,0; 2 0.75,0
C0402 = smd 0.5 x 0.6: 1 -0.5,0; 2 0.5,0
SOD323-L = smd 1 x 0.6: A 1.1,0; C -1.1,0
SOD523 = smd 0.7 x 0.5: A 0.65,0; C -0.65,0
FIDUCIAL_1MM = smd 1 x 1: 1 0,0
LQFP48 = smd 0.28 x 1.2: 1 -2.75,-4.3; 2 -2.25,-4.3; 3 -1.75,-4.3; 4 -1.25,-4.3; 5 -0.75,-4.3; 6 -0.25,-4.3; 7 0.25,-4.3; 8 0.75,-4.3; 9 1.25,-4.3; 10 1.75,-4.3; 11 2.25,-4.3; 12 2.75,-4.3; 25 2.75,4.3; 26 2.25,4.3; 27 1.75,4.3; 28 1.25,4.3; 29 0.75,4.3; 30 0.25,4.3; 31 -0.25,4.3; 32 -0.75,4.3; 33 -1.25,4.3; 34 -1.75,4.3; 35 -2.25,4.3; 36 -2.75,4.3 | smd 1.2 x 0.28: 13 4.3,-2.75; 14 4.3,-2.25; 15 4.3,-1.75; 16 4.3,-1.25; 17 4.3,-0.75; 18 4.3,-0.25; 19 4.3,0.25; 20 4.3,0.75; 21 4.3,1.25; 22 4.3,1.75; 23 4.3,2.25; 24 4.3,2.75; 37 -4.3,2.75; 38 -4.3,2.25; 39 -4.3,1.75; 40 -4.3,1.25; 41 -4.3,0.75; 42 -4.3,0.25; 43 -4.3,-0.25; 44 -4.3,-0.75; 45 -4.3,-1.25; 46 -4.3,-1.75; 47 -4.3,-2.25; 48 -4.3,-2.75
44SSOP = smd 1.6 x 0.28: 1 -3.6,5.25; 2 -3.6,4.75; 3 -3.6,4.25; 4 -3.6,3.75; 5 -3.6,3.25; 6 -3.6,2.75; 7 -3.6,2.25; 8 -3.6,1.75; 9 -3.6,1.25; 10 -3.6,0.75; 11 -3.6,0.25; 12 -3.6,-0.25; 13 -3.6,-0.75; 14 -3.6,-1.25; 15 -3.6,-1.75; 16 -3.6,-2.25; 17 -3.6,-2.75; 18 -3.6,-3.25; 19 -3.6,-3.75; 20 -3.6,-4.25; 21 -3.6,-4.75; 22 -3.6,-5.25; 23 3.6,-5.25; 24 3.6,-4.75; 25 3.6,-4.25; 26 3.6,-3.75; 27 3.6,-3.25; 28 3.6,-2.75; 29 3.6,-2.25; 30 3.6,-1.75; 31 3.6,-1.25; 32 3.6,-0.75; 33 3.6,-0.25; 34 3.6,0.25; 35 3.6,0.75; 36 3.6,1.25; 37 3.6,1.75; 38 3.6,2.25; 39 3.6,2.75; 40 3.6,3.25; 41 3.6,3.75; 42 3.6,4.25; 43 3.6,4.75; 44 3.6,5.25
SOT23-6 = smd 0.6 x 0.9: 1 -0.95,-1.15; 2 0,-1.15; 3 0.95,-1.15; 4 0.95,1.15; 5 0,1.15; 6 -0.95,1.15
SO-8 = smd 1.524 x 0.61: 1 -2.743,1.905; 2 -2.743,0.635; 3 -2.743,-0.635; 4 -2.743,-1.905; 5 2.743,-1.905; 6 2.743,-0.635; 7 2.743,0.635; 8 2.743,1.905
2X03_1.27MM_SMT = smd 0.65 x 2.6: 1 -1.27,-1.85; 2 -1.27,1.85; 3 0,-1.85; 4 0,1.85; 5 1.27,-1.85; 6 1.27,1.85
1X01 = drill 1.016 octagon: 1 0,0
WE-PMI_0806 = smd 0.8 x 1.8: 1 -0.8,0; 2 0.8,0
0603 = smd 0.85 x 0.7: 1 -0.775,0; 2 0.775,0
WE-SLM = smd 1.85 x 0.6: 1 -2.28,0.63; 2 -2.28,-0.62; 3 2.27,-0.62; 4 2.27,0.63
CHIPLED_0603 = smd 0.8 x 0.8: A 0,-0.75; C 0,0.75
R0402 = smd 0.5 x 0.6: 1 -0.5,0; 2 0.5,0
SOT23 = smd 1 x 1.4: 1 -0.95,-1.1; 2 0.95,-1.1; 3 0,1.1
SOT416 = smd 0.5 x 0.6: 1 -0.5,-0.65; 2 0.5,-0.65; 3 0,0.65
R0603 = smd 0.6 x 0.9: 1 -0.75,0; 2 0.75,0
C0805 = smd 0.9 x 1.4: 1 -1.05,0; 2 1.05,0
SOD123 = smd 1.6 x 0.8: 1 -1.7,0; 2 1.7,0
WE-TPC_2828 = smd 3.2 x 1: 1 0,1.1; 2 0,-1.1
MINI_MELF-0207R = smd 1.6 x 2.5: 1 -2.25,0; 2 2.25,0
R0805 = smd 0.9 x 1.4: 1 -1.05,0; 2 1.05,0
SO16WB = smd 1.9 x 0.6: P$1 -4.7,4.445; P$2 -4.7,3.175; P$3 -4.7,1.905; P$4 -4.7,0.635; P$5 -4.7,-0.635; P$6 -4.7,-1.905; P$7 -4.7,-3.175; P$8 -4.7,-4.445; P$9 4.7,-4.445; P$10 4.7,-3.175; P$11 4.7,-1.905; P$12 4.7,-0.635; P$13 4.7,0.635; P$14 4.7,1.905; P$15 4.7,3.175; P$16 4.7,4.445
43650-0509 = smd 1.27 x 2.92: 1 6,5.48; 2 3,5.48; 3 0,5.48; 4 -3,5.48; 5 -6,5.48 | hole 2.41: 8.15,0; -8.15,0
43650-0709 = smd 1.27 x 2.92: 1 9,5.48; 2 6,5.48; 3 3,5.48; 4 0,5.48; 5 -3,5.48; 6 -6,5.48; 7 -9,5.48 | hole 2.41: 11.15,0; -11.15,0
43650-0609 = smd 1.27 x 2.92: 1 7.5,5.48; 2 4.5,5.48; 3 1.5,5.48; 4 -1.5,5.48; 5 -4.5,5.48; 6 -7.5,5.48 | hole 2.41: 9.65,0; -9.65,0
43045-0800 = drill 1.02 square: 1 4.5,4.32 | drill 1.02: 2 1.5,4.32; 3 -1.5,4.32; 4 -4.5,4.32; 5 4.5,7.32; 6 1.5,7.32; 7 -1.5,7.32; 8 -4.5,7.32 | hole 3: 2.35,0; -2.35,0
MT = smd 1.3 x 1: P1 -1.1,-0.9; P2 1.1,-0.9; P3 1.1,0.9; P4 -1.1,0.9

### Placement (x,y rotation side)
C1  65.42,17.64 90 bottom
C2  55.7,27.25 90 bottom
C3  28.45,13.45 180 top
C4  33.3,6.3 180 bottom
C5  28.73,20.98 270 top
C6  8,27.1 270 bottom
C7  12.5,22.9 270 top
C14  27.25,1.3 0 bottom
C15  26.75,4.9 270 bottom
C17  13.9,22.45 270 top
C22  23.85,6 90 bottom
C23  27.45,11.55 0 top
C27  27.2,22.45 270 top
C34  30.05,5.65 270 bottom
CCM1  32.55,10.9 0 bottom
CCM2  36.3,10.9 0 bottom
CCM3  40.05,10.9 0 bottom
CCM4  43.8,10.9 0 bottom
CCM5  47.55,10.9 0 bottom
CCM6  51.3,10.9 0 bottom
CCM7  55.05,10.9 0 bottom
CCM8  58.8,10.9 0 bottom
CCM9  62.55,10.9 0 bottom
CCM10  66.3,10.9 0 bottom
CCM11  70.05,10.9 0 bottom
CCM12  70.85,9.1 90 bottom
CVREF  56.8,27.25 270 bottom
CVREG  58,27.25 270 bottom
D1  57.99,6.87 0 bottom
D2  73.89,18.11 90 bottom
DCM1  32.55,12.12 0 bottom
DCM2  36.3,12.12 0 bottom
DCM3  40.05,12.12 0 bottom
DCM4  43.8,12.12 0 bottom
DCM5  47.55,12.12 0 bottom
DCM6  51.3,12.12 0 bottom
DCM7  55.05,12.12 0 bottom
DCM8  58.8,12.12 0 bottom
DCM9  62.55,12.12 0 bottom
DCM10  66.3,12.12 0 bottom
DCM11  70.05,12.12 0 bottom
DCM12  72.53,9.1 90 bottom
DT1  33.12,16.8 270 top
DT2  40.65,16.8 270 top
DT3  48.12,16.8 270 top
DT4  55.62,19.35 270 top
DT5  63.12,19.35 270 top
DT6  70.62,19.35 270 top
FID2  2.58,8.91 0 top
FID3  59.12,1.49 0 top
FID4  32.05,28.1 0 top
FID7  24.28,28.37 0 bottom
FID8  1.72,16.16 0 bottom
FID9  58,20.6 0 bottom
FID10  64,1.55 0 bottom
IC1  27.71,5.51 270 top
IC2  57.96,20.57 90 bottom
IC3  9.6,6.05 270 top
IC5  12.89,27.1 180 bottom
J1  38.55,4.25 0 top
JP1  5.5,6.65 0 bottom
L2  14.3,10.45 270 top
L7  63.13,7.92 0 bottom
L12  10.5,27.3 180 top
LED1  35.3,2.05 180 top
LED2  33.8,2.05 180 top
NTC_C1  43.15,24.1 90 bottom
NTC_C2  34.15,24.1 90 bottom
NTC_C3  31.15,24.1 90 bottom
NTC_C4  40.15,24.1 90 bottom
NTC_R1  43.15,22 270 bottom
NTC_R2  34.15,22 270 bottom
NTC_R3  31.15,22 270 bottom
NTC_R4  40.15,22 270 bottom
Q1  68.86,18.1 270 bottom
Q2  68.78,22.89 90 bottom
QB1  33.8,11.45 90 top
QB2  37.55,11.45 90 top
QB3  41.3,11.45 90 top
QB4  45.05,11.45 90 top
QB5  48.8,11.45 90 top
QB6  52.55,11.45 90 top
QB7  56.3,11.45 90 top
QB8  60.05,11.45 90 top
QB9  63.8,11.45 90 top
QB10  67.55,11.45 90 top
QB11  71.3,11.45 90 top
QB12  73.5,8.15 0 top
R1  63.64,27.28 270 bottom
R2  35.3,6.55 90 top
R3  59.53,27.28 270 bottom
R4  61.57,27.28 270 bottom
R5  60.55,27.28 270 bottom
R6  27.85,17.93 180 top
R7  27.85,19.05 180 top
R8  33.8,6.55 90 top
R9  28.75,15.35 90 top
R11  30.05,1.55 90 bottom
R15  31.89,8.3 270 bottom
R19  62.65,27.28 90 bottom
R39  17.55,24.68 270 bottom
R40  10.99,22.19 180 bottom
R41  10.99,23.52 180 bottom
R52  30.68,8.3 270 bottom
R59  72.1,23 0 top
R60  54.65,27.25 270 bottom
RBG1  34.45,11.75 90 bottom
RBG2  38.2,11.75 90 bottom
RBG3  41.95,11.75 90 bottom
RBG4  45.7,11.75 90 bottom
RBG5  49.45,11.75 90 bottom
RBG6  53.2,11.75 90 bottom
RBG7  56.95,11.75 90 bottom
RBG8  60.7,11.75 90 bottom
RBG9  64.45,11.75 90 bottom
RBG10  68.2,11.75 90 bottom
RBG11  71.65,11.75 90 bottom
RBG12  73.15,12.2 90 bottom
RCM1  35.45,11.6 270 top
RCM2  39.2,11.6 270 top
RCM3  42.95,11.6 270 top
RCM4  46.7,11.6 270 top
RCM5  50.45,11.6 270 top
RCM6  54.2,11.6 270 top
RCM7  57.95,11.6 270 top
RCM8  61.7,11.6 270 top
RCM9  65.45,11.6 270 top
RCM10  69.25,11.6 270 top
RCM11  73,11.6 270 top
RCM12  70.42,8 90 top
REG5_C1  9.53,2.6 270 top
REG5_C2  10.1,8.6 180 bottom
REG5_C3  12.05,2.6 270 top
REG5_C4  17.15,9.95 90 top
REG5_C5  14.4,2.6 270 top
REG5_D1  10.45,6.28 270 bottom
REG5_D2  16.85,5.1 270 top
REG5_L  13.65,6.55 0 top
REG5_R1  7.1,5.45 270 bottom
REG5_R2  9.6,4.3 180 bottom
RGQ1_1  72.07,18.11 90 bottom
RGQ1_2  73.11,22.18 180 bottom
RGQ1_3  65.83,22.95 270 bottom
RP1  31.25,16.1 90 top
RP2  35,16.1 270 top
RP3  38.75,16.1 90 top
RP4  42.5,16.1 270 top
RP5  46.25,16.1 90 top
RP6  50,16.1 270 top
RP7  53.75,16.1 90 top
RP8  57.5,16.1 270 top
RP9  61.25,16.1 90 top
RP10  65,16.1 270 top
RP11  68.75,16.1 90 top
RP12  72.5,16.1 270 top
RV1  14.85,17.25 90 bottom
RV2  4.65,22.05 90 bottom
RV3  6.3,22.05 90 bottom
U$2  20.7,18.65 0 top
U$3  [SMLOGOS_BSILK]  52.8,5.4 0 top
V+R  62.24,5.77 270 bottom
V-R  42.02,6.12 270 top
X1  37.15,28.02 180 top
X3  55.7,1.98 0 top
X6  57.85,28.02 180 top
X7  4.6,16.05 270 top
Y1  24.47,2.6 90 bottom

### Tracks (layer width: path | path; a pad name or v marks a point on that pad's centre or on a via)
!RESET  (via drill 0.2)
  Top 0.15: IC1.3 24.51,7.26 24.75,7.5 29.55,7.5 v29.85,7.8 30.3,7.8 30.9,7.2 v30.9,4.8 | J1.1 37.28,2.03 37.2,1.95 v36.45,1.95
  Bottom 0.15: C34.1 30,6.15 29.85,6.3 v29.85,7.8 R52.2 | v30.9,4.8 30.9,3.45 31.5,2.85 31.5,1.95 31.8,1.65 36.15,1.65 v36.45,1.95
+3V3  (via drill 0.2)
  Top 0.15: J1.2 37.28,7.05 R2.2 R8.2 v33.8,8.05 | R9.2 v28.75,16.8
  Top 0.2: v64.65,27.75 63.35,27.75 v62.65,28.45 59.92,25.73 v56.2,25.73
  Top 0.27: IC1.8 24.41,4.76 v24.45,4.8 v24.9,4.8 | IC1.44 26.96,11.24 C23.1
  Top 0.3: v23.1,8.85 v23.1,9.3 23.85,9.3 | C23.1 26.95,11.45 v26.4,12 v25.8,12 25.65,12 24.15,10.5 24.15,9.6 23.85,9.3 | v26.77,15.47 U$2.P$10 | v29.7,21.15 v29.7,21.6 29.57,21.73 C5.1 | 23.85,9.3 25.05,8.1 29.25,8.1 29.85,8.7 v29.95,8.7 | v46.05,22.5 47.85,22.5 48.6,23.25 48.6,24.15 49.5,25.05 52.2,25.05 53.85,26.7 55.8,26.7 56.2,26.3 v56.2,25.73
  Top 0.5: U$2.P$16 26.85,23.1 27,22.95 C27.1 28.05,22.95 28.73,22.27 C5.1
  Bottom 0.15: RGQ1_3.2 65.85,22.45 65.95,22.35 67.28,22.35 Q2.1 67.94,21.94 68.8,22.8 68.8,25.35 67.75,26.4 66,26.4 v64.65,27.75 | R15.1 33.05,8.8 v33.8,8.05
  Bottom 0.2: R19.2 v62.65,28.45 | IC2.30 56.21,25.57 v56.2,25.73
  Bottom 0.3: C22.1 23.3,5.5 23.1,5.7 v23.1,8.85 v23.1,9.3 | v25.8,12 v26.4,12 26.4,15.1 v26.77,15.47 28.1,16.8 v28.75,16.8 29.1,16.8 30.15,17.85 30.15,20.7 v29.7,21.15 v29.7,21.6 29.8,21.5 NTC_R3.2 31.25,21.5 31.35,21.6 34.05,21.6 NTC_R2.2 36.95,21.5 37.95,22.5 38.85,22.5 39.85,21.5 NTC_R4.2 40.55,21.5 41.4,22.35 42,22.35 42.85,21.5 NTC_R1.2 45.05,21.5 v46.05,22.5 v46.65,22.5 | R15.1 R52.1 30.1,8.8 v29.95,8.7
  Bottom 0.5: v24.9,4.8 24.55,4.8 C22.1
BAL1
  Bottom 0.15: IC2.25 53.71,25.34 53.4,25.65 52.35,25.65 51.15,24.45 51.15,16.05 50.85,15.75 37.95,15.75 RBG1.2
BAL2
  Bottom 0.15: IC2.23 52.71,23.46 51.75,22.5 51.75,15.75 51.15,15.15 41.1,15.15 RBG2.2
BAL3
  Bottom 0.15: IC2.21 53.21,15.26 52.5,14.55 44.25,14.55 RBG3.2
BAL4
  Bottom 0.15: IC2.19 54.21,14.76 53.4,13.95 47.4,13.95 RBG4.2
BAL5
  Bottom 0.15: IC2.17 55.21,14.56 54,13.35 50.55,13.35 RBG5.2
BAL6
  Bottom 0.15: IC2.15 56.21,14.51 54.45,12.75 53.7,12.75 RBG6.2
BAL7
  Bottom 0.15: IC2.13 57.21,12.51 RBG7.2
BAL8
  Bottom 0.15: IC2.11 58.21,13.04 58.5,12.75 60.2,12.75 RBG8.2
BAL9
  Bottom 0.15: IC2.9 59.21,13.84 59.7,13.35 63.35,13.35 RBG9.2
BAL10
  Bottom 0.15: IC2.7 60.21,14.79 61.05,13.95 66.5,13.95 RBG10.2
BAL11
  Bottom 0.15: IC2.5 61.21,15.29 61.95,14.55 69.35,14.55 RBG11.2
BAL12
  Bottom 0.15: IC2.3 62.21,15.74 62.8,15.15 70.7,15.15 RBG12.2
BOOST1  (via drill 0.2)
  Top 0.3: IC3.1 v7.53,7 v7,7
  Bottom 0.3: v7.53,7 v7,7 8.82,7 9.6,7.78 | REG5_C2.1 9.6,7.78 | 9.6,7.78 REG5_D1.C
C0  (via drill 0.2)
  Top 0.3: X3.7 46.7,8.2 46.2,8.7 33.9,8.7 v32.33,10.28 32.25,10.35 32.25,13.35 31.75,13.85 RP1.1
  Top 0.6: 46.58,6.88 46.6,6.9 46.6,7.36 X3.7 | V-R.1 43.02,6.88
  Top 1.1: 46.58,6.88 v44.12,6.88 43.02,6.88
  Bottom 0.15: IC2.26 54.21,25.29 53.55,25.95 52.2,25.95 50.85,24.6 50.85,16.2 50.7,16.05 35.83,16.05 DCM1.A
  Bottom 0.25: CCM1.2 32.05,11.97 DCM1.A
  Bottom 0.3: CCM1.2 32.05,10.55 v32.33,10.28
  Bottom 0.6: D1.A 45.23,6.87 v45.23,6.88 v44.67,6.88 v44.12,6.88
C1
  Top 0.2: QB1.2 34.5,12 35.35,12 RCM1.1
  Top 0.3: X6.1 50.5,22 49.8,21.3 48,21.3 47.1,20.4 40.8,20.4 40.05,19.65 36.6,19.65 35.3,18.35 RP2.1 | RP2.1 35,17.9 | 34.5,12 33.85,12 33.38,12.47 33.38,14.95 35,16.57 RP2.1
C1M  (via drill 0.2)
  Top 0.25: RCM1.2 35.45,9.95 v35.3,9.8
  Bottom 0.15: IC2.24 53.21,25.09 52.95,25.35 52.5,25.35 51.45,24.3 51.45,15.9 51,15.45 38.98,15.45 DCM2.A
  Bottom 0.25: DCM1.C 33.05,11.97 CCM1.1 34.15,9.8 v35.3,9.8 35.8,10.3 CCM2.2 35.8,11.97 DCM2.A
C2
  Top 0.2: QB2.2 38.25,12 39.1,12 RCM2.1
  Top 0.3: X3.6 49.7,8.35 48.75,9.3 40.8,9.3 39.9,10.2 39.9,11.85 39.65,12.1 RCM2.1
  Top 0.5: QB2.2 38.2,13.3 RP3.1
C2M  (via drill 0.2)
  Top 0.25: RCM2.2 39.2,9.95 v39.05,9.8
  Bottom 0.15: IC2.22 52.71,15.21 52.35,14.85 42.12,14.85 DCM3.A
  Bottom 0.25: DCM2.C 36.8,11.97 CCM2.1 37.9,9.8 v39.05,9.8 39.55,10.3 CCM3.2 39.55,11.97 DCM3.A
C3
  Top 0.2: QB3.2 42,12 42.85,12 RCM3.1
  Top 0.3: X6.2 53.35,21.1 52.8,20.55 48.3,20.55 47.55,19.8 44.25,19.8 42.8,18.35 RP4.1 42.5,16.55 40.85,14.9 40.85,12.65 41.55,11.95 QB3.2
C3M  (via drill 0.2)
  Top 0.25: RCM3.2 42.95,10.25 v43.1,10.1
  Bottom 0.15: IC2.20 53.71,15.01 52.95,14.25 45.27,14.25 DCM4.A
  Bottom 0.25: DCM3.C 40.55,11.97 CCM3.1 41.65,9.8 42.8,9.8 v43.1,10.1 43.3,10.3 CCM4.2 43.3,11.97 DCM4.A
C4
  Top 0.2: QB4.2 45.65,11.95 45.6,12 46.6,12 RCM4.1
  Top 0.3: X3.5 52.7,8.5 51.75,9.45 49.5,9.45 48.75,10.2 48,10.2 47.4,10.8 47.4,11.85 47.15,12.1 RCM4.1
  Top 0.5: QB4.2 45.7,13.3 RP5.1
C4M  (via drill 0.2)
  Top 0.25: RCM4.2 46.7,10.25 v46.85,10.1
  Bottom 0.15: IC2.18 54.71,14.66 53.7,13.65 48.42,13.65 DCM5.A
  Bottom 0.25: DCM4.C 44.3,11.97 CCM4.1 45.4,9.8 46.55,9.8 v46.85,10.1 47.05,10.3 CCM5.2 47.05,11.97 DCM5.A
C5
  Top 0.2: QB5.2 49.5,12 50.35,12 RCM5.1
  Top 0.3: 56.35,21.4 X6.3 56.31,22.5 54.9,22.5 54.45,22.05 54.45,20.55 53.7,19.8 51.9,19.8 50.45,18.35 RP6.1 50,16.6 48.35,14.95 48.35,12.65 49.05,11.95 QB5.2
C5M  (via drill 0.2)
  Top 0.25: RCM5.2 50.45,10.25 v50.6,10.1
  Bottom 0.15: IC2.16 55.71,14.46 54.3,13.05 51.58,13.05 DCM6.A
  Bottom 0.25: DCM5.C 48.05,11.97 CCM5.1 49.15,9.8 50.3,9.8 v50.6,10.1 50.8,10.3 CCM6.2 50.8,11.97 DCM6.A
C6
  Top 0.2: QB6.2 53.25,12 54.1,12 RCM6.1
  Top 0.3: RCM6.1 54.65,12.1 54.9,11.85 54.9,10.5 55.7,9.7 X3.4
  Top 0.5: QB6.2 53.2,13.3 RP7.1
C6M  (via drill 0.2)
  Top 0.25: RCM6.2 54.2,10.25 v54.35,10.1
  Bottom 0.15: IC2.14 56.71,14.43 DCM7.A
  Bottom 0.25: DCM6.C 51.8,11.97 CCM6.1 52.9,9.8 54.05,9.8 v54.35,10.1 54.55,10.3 CCM7.2 54.55,11.97 DCM7.A
C7
  Top 0.2: QB7.2 57,12 57.85,12 RCM7.1
  Top 0.3: QB7.2 56.55,11.95 55.85,12.65 55.85,14.93 57.5,16.57 RP8.1 57.95,18.35 59.35,19.75 X6.4
C7M  (via drill 0.2)
  Top 0.25: RCM7.2 57.95,9.95 v57.8,9.8
  Bottom 0.15: IC2.12 57.71,12.57 DCM8.A
  Bottom 0.25: DCM7.C 55.55,11.97 CCM7.1 56.65,9.8 v57.8,9.8 58.3,10.3 CCM8.2 58.3,11.97 DCM8.A
C8
  Top 0.25: QB8.2 60.75,12 61.6,12 RCM8.1
  Top 0.3: RCM8.1 62.15,12.1 62.4,11.85 62.4,9.75 61.95,9.3 59.7,9.3 58.7,8.3 X3.3
  Top 0.5: QB8.2 60.7,13.3 RP9.1
C8M  (via drill 0.2)
  Top 0.25: RCM8.2 61.7,10.25 v61.55,10.1
  Bottom 0.15: IC2.10 58.71,13.44 59.1,13.05 60.98,13.05 DCM9.A
  Bottom 0.25: DCM8.C 59.3,11.97 CCM8.1 60.4,9.8 61.25,9.8 v61.55,10.1 62.05,10.6 CCM9.2 62.05,11.97 DCM9.A
C9
  Top 0.2: QB9.2 64.5,12 65.35,12 RCM9.1
  Top 0.3: QB9.2 64.05,11.95 63.35,12.65 63.35,14.93 65,16.57 RP10.1 64.75,18.35 64.2,18.9 64.2,20.25 62.35,22.1 X6.5
C9M  (via drill 0.2)
  Top 0.25: RCM9.2 65.45,10.25 v65.6,10.1
  Bottom 0.15: IC2.8 59.71,14.69 60.75,13.65 64.12,13.65 DCM10.A
  Bottom 0.25: DCM9.C 63.05,11.97 CCM9.1 64.15,9.8 65.3,9.8 v65.6,10.1 65.8,10.3 CCM10.2 65.8,11.97 DCM10.A
C10
  Top 0.25: RCM10.1 69.15,12 68.25,12 QB10.2
  Top 0.3: X3.2 61.7,8.15 63,9.45 69.45,9.45 69.9,9.9 69.9,11.85 69.65,12.1 RCM10.1
  Top 0.5: QB10.2 68.2,13.3 RP11.1
C10M  (via drill 0.2)
  Top 0.25: RCM10.2 69.25,10.4 v68.95,10.1
  Bottom 0.15: IC2.6 60.71,15.04 61.5,14.25 67.28,14.25 DCM11.A
  Bottom 0.25: DCM10.C 66.8,11.97 CCM10.1 67.9,9.8 68.6,9.8 69,10.05 v68.95,10.1 69.55,10.7 CCM11.2 69.55,11.97 DCM11.A
C11
  Top 0.2: QB11.2 72,12 72.9,12 RCM11.1
  Top 0.3: QB11.2 71.55,11.95 70.85,12.65 70.85,14.93 72.5,16.57 RP12.1 72.1,18.35 71.7,18.75 71.7,20.7 70.2,22.2 65.69,22.2 X6.6
C11M  (via drill 0.2)
  Top 0.25: RCM11.2 73,10.65 v72.85,10.5
  Bottom 0.15: IC2.4 61.71,15.54 62.4,14.85 70.12,14.85 70.28,14.72 72.4,12.6 72.4,10.95 v72.85,10.5
  Bottom 0.25: DCM11.C 70.55,11.97 CCM11.1 70.6,10.9 70.6,10.8 70.85,10.55 CCM12.2 72.38,9.6 DCM12.A 72.53,10.18 v72.85,10.5
C12  (via drill 0.2)
  Top 0.3: X3.1 64.74,7.5 RCM12.1 70.45,7.5 71.2,6.75 73.75,6.75 74,7 QB12.2
  Top 0.6: v67.15,8.25 64.75,8.25 64.75,7.51 X3.1
  Bottom 0.6: L7.1 65.62,7.92 v65.95,8.25 v66.55,8.25 v67.15,8.25
C12M  (via drill 0.2)
  Top 0.15: RCM12.2 70.55,8.5 70.6,8.55 v69.55,8.55
  Bottom 0.15: IC2.2 62.71,15.84 63.1,15.45 71.95,15.45 73.75,13.65 73.75,7.8 72.85,6.9 72.1,6.9 70.85,8.15 CCM12.1 70.9,8.6 70.95,8.55 | 71.8,8.55 70.95,8.55 | 70.95,8.55 v69.55,8.55
  Bottom 0.25: CCM12.1 72.38,8.6 DCM12.C
CANH
  Top 0.4: X7.3 8.1,17.55 7.35,18.3 7.35,26.25 7.77,26.67 L12.4
  Top 1: X7.3 X7.7
  Bottom 0.6: RV3.1 8.92,18.68 X7.3
CANL
  Top 0.4: X7.2 8.92,15.23 6.75,17.4 6.75,27.45 7.22,27.92 L12.3
  Top 1: X7.6 X7.2
  Bottom 0.6: RV2.1 4.8,21.3 7.65,18.45 7.65,15.82 X7.2
CANRX
  Top 0.15: U$2.P$14 26.7,20.55 27.35,19.9 R7.2
CANRX_U_L  (via drill 0.2)
  Top 0.15: IC1.19 27.96,2.16 v28.95,3.15 | R7.1 v28.8,19.05
  Bottom 0.15: v28.95,3.15 29.1,3.3 29.1,7.05 24,12.15 24,17.4 25.65,19.05 v28.8,19.05
CANTX
  Top 0.15: U$2.P$13 26.46,19.29 26.7,19.05 26.7,18.59 R6.2
CANTX_U_L  (via drill 0.2)
  Top 0.15: IC1.20 28.46,1.91 v28.95,2.4 | R6.1 28.81,17.93 v28.82,17.95
  Bottom 0.15: v28.95,2.4 29.55,3 29.55,3.45 29.4,3.6 29.4,7.2 24.3,12.3 24.3,16.95 25.3,17.95 v28.82,17.95
CAR+5V  (via drill 0.2)
  Top 0.3: U$2.P$6 v17.39,16.75 v17.4,16.75 | U$2.P$7 17.43,15.47 v17.4,15.45
  Top 0.5: U$2.P$1 14.04,23.09 C17.1 13.2,23.65 C7.1 12.5,24.8 v12.75,24.9
  Top 1.1: v13.2,24.9 v12.75,24.9 v12.3,24.9
  Bottom 0.3: JP1.1 5.5,5 7.2,3.3 11.25,3.3 v12.45,4.5 11.4,5.55 10.53,5.55 REG5_D1.A 10.1,5.28 REG5_R2.2
  Bottom 0.5: C6.1 8.7,27.6 8.84,27.73 IC5.3 11.87,27.73 12.3,27.3 v12.3,24.9 | v14.85,4.5 v12.45,4.5 14.85,6.9 v14.85,4.5 | v14.85,4.5 14.7,4.5 14.55,4.65 14.55,6.15 14.55,6.3 13.05,4.8 14.25,4.8 14.25,5.55 13.8,5.1
  Bottom 1.1: 14.55,6.15 14.55,12.6 v17.4,15.45 v17.4,16.75 17.4,20.7 v13.2,24.9 v12.75,24.9 v12.3,24.9
  other vias: 13.05,4.5 13.65,4.5 14.25,4.5
  pour Top (rank 2, no thermals): 11.22,2.67 11.22,3.85 12.12,4.75 12.12,5.88 15.18,5.88 15.18,2.67
CAR_CANRX  (via drill 0.2)
  Top 0.2: U$2.P$3 14.85,20.55 v14.55,20.85
  Bottom 0.2: R41.2 11.88,23.52 v14.55,20.85
CAR_CANRX_T  (via drill 0.2)
  Top 0.15: v9.62,23.52 9.62,27.98 10.65,29 11.64,29 v11.62,29
  Bottom 0.2: R41.1 9.63,23.52 v9.62,23.52 | IC5.4 11.64,29 v11.62,29
CAR_CANTX  (via drill 0.2)
  Top 0.2: U$2.P$4 15.21,19.29 v14.55,19.95
  Bottom 0.2: R40.2 12.31,22.19 v14.55,19.95
CAR_CANTX_T
  Bottom 0.2: R40.1 9.46,22.19 9,22.65 9,24.6 9.6,25.2 IC5.1
CARGND  (via drill 0.2)
  Top 0.3: U$2.P$2 17.02,21.82 17.55,22.35 v17.55,23.25
  Top 0.4: U$2.P$8 15.4,14.21 14.78,13.57 | U$2.P$5 13.52,18.02 13.8,17.7
  Top 0.5: 17.85,12.3 v17.85,12.6 v17.25,12.6 v16.65,12.6 v16.05,12.6 | 17.85,12.3 v17.85,12 | 17.85,12.3 16.05,12.3 v16.05,12 v16.65,12 v17.25,12 v17.85,12 | v17.85,12 17.85,11.25 17.55,10.95
  Top 0.6: U$2.P$2 14.03,21.82 C17.2 12.7,21.95 C7.2 12.5,21.13 X7.8
  Top 1.2: REG5_C4.2 17.15,11.2
  Top 1.5: X7.4 X7.8 13.8,18.67 13.8,17.7 13.8,14.55 14.78,13.57 16.05,12.3 17.15,11.2
  Bottom 0.3: REG5_R1.1 6.55,5.95 v6.17,5.58 | R39.2 17.55,24.15 17.55,23.55 v17.55,23.25
  Bottom 0.5: IC5.2 8.84,26.46 8.7,26.6 C6.2 8,23.5 | v16.05,12.6 16.95,12.6 | 17.4,12.6 v17.85,12.6 17.85,0.6 v16.05,0.6 v16.05,12.6 | v16.05,12.6 16.5,12.6 16.5,0.75 16.95,0.75 16.95,12.6 | 16.95,12.6 17.4,12.6 | 17.4,12.6 17.4,0.75
  Bottom 0.6: 8,22.8 RV3.2 RV2.2
  Bottom 1: 8,23.5 8,22.8 8,21.47 X7.4 X7.8 14.17,18.3 RV1.2
  other vias: 16.65,0.6 15.45,0.6 14.85,0.6 14.25,0.6 13.65,0.6 13.05,0.6 12.45,0.6 11.85,0.6 11.25,0.6 10.65,0.6 10.05,0.6 9.45,0.6 8.85,0.6 8.25,0.6 7.65,0.6 7.05,0.6 6.6,1.05
  pour Top (rank 6, no thermals): 8.82,5.83 7.95,5.83 7.75,5.62 7.75,2.9 8.55,2.1 15.45,2.1 16.05,2.7 16.05,3.9 16.35,4.2 17.85,4.2 18.15,3.9 18.15,0.9 17.55,0.3 6.75,0.3 6,1.05 6,5.7 6.58,6.28 8.82,6.28
  pour Bottom (rank 6, no thermals): 8.55,2.1 15.45,2.1 16.05,2.7 16.05,3.9 16.35,4.2 17.85,4.2 18.15,3.9 18.15,0.9 17.55,0.3 6.75,0.3 6,1.05 6,2.1
CARVIN
  Top 0.8: X7.5 12.22,11.25 L2.1 14.9,11.25 17.15,9 REG5_C4.1
  Top 1: X7.1 X7.5
  Bottom 1: RV1.1 14.85,15 11.92,12.07 X7.5
CARVINFILT
  Top 0.8: 9.9,4.8 9.6,5.1 9.6,8.1 11.15,9.65 L2.2
  pour Top (no thermals): 10.38,6.28 11.12,6.28 11.12,4.45 10.35,3.67 10.35,2.67 8.7,2.67 8.7,3.8 10.38,5.47
CR1
  Top 0.3: QB1.3 33.15,11.55 32.9,11.8 32.9,14.95 31.25,16.6 RP1.2
CR2
  Top 0.3: QB2.3 36.88,11.45 36.67,11.65 36.67,12.68 36,13.35 35.5,13.35 RP2.2
CR3
  Top 0.3: QB3.3 40.6,11.45 40.4,11.65 40.4,14.93 38.75,16.57 RP3.2
CR4
  Top 0.3: QB4.3 44.4,12.3 42.85,13.85 RP4.2
CR5
  Top 0.3: QB5.3 48.15,11.47 47.9,11.72 47.9,14.95 46.25,16.6 RP5.2
CR6
  Top 0.3: QB6.3 51.9,12.45 50.5,13.85 RP6.2
CR7
  Top 0.3: QB7.3 55.62,11.45 55.4,11.68 55.4,14.93 53.75,16.57 RP7.2
CR8
  Top 0.3: QB8.3 59.4,12.3 57.85,13.85 RP8.2
CR9
  Top 0.3: QB9.3 62.9,11.7 62.9,14.93 61.25,16.57 RP9.2
CR10
  Top 0.3: QB10.3 66.9,12.45 65.5,13.85 RP10.2
CR11
  Top 0.3: QB11.3 70.4,11.7 70.4,14.93 68.75,16.57 RP11.2
CR12
  Top 0.3: QB12.3 73.5,9 73.95,9.45 73.95,12.9 73.35,13.5 72.85,13.5 RP12.2
CSB
  Bottom 0.2: IC2.44 63.21,26.35 R1.2
FB1  (via drill 0.2)
  Top 0.3: IC3.3 8.45,4.55 v8.25,4.35
  Bottom 0.3: REG5_R1.2 7.7,4.35 v8.25,4.35 8.3,4.3 REG5_R2.1
FSM  (via drill 0.2)
  Top 0.15: v54.75,25.65 55.35,25.05 69.15,25.05 71.2,23 R59.1 | IC1.30 32.91,5.26 v33.05,5.4
  Bottom 0.15: v54.75,25.65 54.75,26.65 R60.2 52.55,26.75 51,25.2 25.95,25.2 24,23.25 24,20.7 24.9,19.8 29.1,19.8 29.55,19.35 29.55,17.85 29.1,17.4 25.35,17.4 24.6,16.65 24.6,12.45 27.7,9.35 33.25,9.35 34.35,8.25 34.35,7.65 33.9,7.2 33.15,7.2 32.8,6.85 C4.1 32.8,5.65 v33.05,5.4
  Bottom 0.2: IC2.29 55.71,24.84 55.7,24.85 55.67,24.82 55.67,26.73 C2.1
  Bottom 0.27: C2.1 R60.2
GND  (via drill 0.2)
  Top 0.15: DT1.C 33.12,19.32 33.9,20.1 v35.55,20.1 37.15,21.7 X1.3 | DT2.C v40.65,18.3 | DT4.C v56.25,20 | DT5.C 63.12,20.12 62.85,20.4 v61.35,20.4 | DT6.C 70.62,20.3 v69.88,21.05 | DT3.C 48.12,19.48 v48.45,19.8 | v46.65,24.15 46.65,25.8
  Top 0.27: IC1.5 24.71,6.26 25.05,6.6 v25.5,6.6 v25.95,6.6 v26.4,6.6 | IC1.41 28.46,10.99
  Top 0.3: V-R.2 40.02,5.38 39.9,5.25 39.9,6.02 J1.6 | U$2.P$9 27.41,14.21 27.75,14.55 27.75,16.35 27.36,16.75 U$2.P$11 | C3.2 27.95,13 27.7,12.75
  Top 0.5: C5.2 28.68,20.23 27.2,21.7 C27.2 26.75,21.95 26.62,21.82 U$2.P$15 23.62,21.82 22.95,21.15 22.95,14.1 | v23.1,10.5 v23.1,10.05 v23.55,10.05 v23.1,10.5 | v23.1,10.5 23.1,12 | 23.1,12 23.1,12.15 23.7,12.75 | 23.7,12.75 27.7,12.75 28.46,11.99 28.46,11.55 | 28.46,10.99 28.46,11.55 | C23.2 28.46,11.55 | 23.7,12.75 22.95,13.5 22.95,14.1 | U$2.P$9 23.05,14.21 22.95,14.1 | 23.43,11.45 23.43,11.68 23.1,12 | 37.2,25.8 37.15,25.9 v37.15,24.6 X1.3
  Top 0.6: v66.4,25.65 65.5,26.55 v64.6,25.65 v66.4,25.65 | v66.4,25.65 v65.8,25.65 65.5,25.95 65.5,28.5 64.6,29.4 50.85,29.4 50.1,28.65 50.1,27.3 48.6,25.8 | V-R.2 42.02,4.58
  Top 1.1: 42.02,4.58 v42.02,1.98
  Top 1.4: 48.6,25.8 46.65,25.8 37.2,25.8 25.35,25.8
  Top 1.6: 25.35,25.8 23.43,23.88 23.43,11.45
  Bottom 0.15: v40.65,18.3 40.65,18.9 39.6,19.95 35.7,19.95 v35.55,20.1 | 56.25,22.65 v56.25,20 | v61.35,20.4 61.35,22.65 | v69.88,21.05 65.15,21.05 64.55,20.45 | v48.45,19.8 48.45,22.35 v46.65,24.15
  Bottom 0.27: IC2.40 61.21,22.65 | IC2.33 57.71,22.65 | IC2.39 60.71,22.66 60.7,22.65 | IC2.38 60.21,22.66 60.2,22.65 | IC2.37 59.71,22.66 59.7,22.65 | IC2.36 59.21,22.66 59.2,22.65 | 58.7,22.65 58.71,22.66 IC2.35 58.71,25.56 58.8,25.65 | IC2.34 58.21,22.66 58.2,22.65 | IC2.27 54.71,22.65 | R60.1 C2.2 CVREF.1
  Bottom 0.3: RGQ1_3.1 67.29,23.45 Q2.2 | CVREF.1 CVREG.1 58.5,27.75 58.8,27.45 58.8,25.65 | C34.2 30.05,3.4 30.9,2.55 | NTC_C3.2 NTC_C2.2 v37.15,24.6 NTC_C4.2 NTC_C1.2
  Bottom 0.5: 54.71,22.65 56.25,22.65 57.71,22.65 58.2,22.65 58.7,22.65 59.2,22.65 59.7,22.65 60.2,22.65 60.7,22.65 61.21,22.65 61.35,22.65 62.35,22.65 63.17,21.82 | 63.17,21.82 64.55,20.45 65.42,19.58 C1.2 | RGQ1_3.1 65.33,23.45 64.8,23.45 63.17,21.82 | v26.4,6.6 26.4,5.75 | v26.4,6.6 v25.5,6.6 | v25.5,6.6 25.95,7.2 | v26.4,6.6 25.95,7.2 | 25.95,7.2 25.95,7.65 v23.55,10.05 | v23.55,10.05 v23.1,10.05 v23.1,10.5 v23.55,10.05 | v42.02,1.98 v42.02,2.42 | C22.2 25.4,6.5 v25.5,6.6 | 27.75,4.58 C14.1
  Bottom 0.6: v65.2,25.65 v65.8,25.65 v66.4,25.65 65.5,24.75 v64.6,25.65 v65.2,25.65 | v65.2,25.65 65.5,25.35 65.5,23.62 65.33,23.45
  Bottom 1.1: 31.15,0.85 40.9,0.85 v42.02,1.98
  other vias: 26.27,3.75 24.25,0.57
  pour Bottom: 22.8,0 34.8,0 34.8,9.45 22.8,9.45
  pour Top: 22.8,0 32.1,0 32.1,9.45 22.8,9.45
ISP_CAN  (via drill 0.2)
  Top 0.15: IC1.14 25.46,2.06 25.65,2.25 27.3,2.25 28.5,3.45 v28.5,3.75
  Bottom 0.15: v28.5,3.75 28.5,3.45 28.35,3.3 28.35,2.25 28.8,1.8 29.8,1.8 R11.2
ISP_ENTER  (via drill 0.2)
  Top 0.15: IC1.4 24.61,6.76 25.05,7.2 30.15,7.2 v30.38,7.05 | J1.5 39.82,3.78 39.35,4.25 v33.17,4.25
  Bottom 0.15: v30.38,7.05 31.14,7.05 | 31.14,7.05 R15.2 | 31.14,7.05 31.14,5.76 32.65,4.25 v33.17,4.25
LED1
  Top 0.15: IC1.24 30.46,0.74 30.75,0.45 34.6,0.45 LED1.C
LED2
  Top 0.15: LED2.C 32.9,1.3 32.01,2.19 IC1.25
MISO0  (via drill 0.2)
  Top 0.15: IC1.27 29.99,3.76 v28.5,5.25 | v51.15,26.7 v51.15,28.2
  Bottom 0.15: v28.5,5.25 27.9,5.85 27.9,7.35 23.4,11.85 23.4,23.55 25.65,25.8 50.1,25.8 51,26.7 v51.15,26.7 | v51.15,28.2 51.15,28.5 51.6,28.95 60.9,28.95 61.57,28.28 R4.1
MOSI0  (via drill 0.2)
  Top 0.15: IC1.28 30.24,4.26 v28.5,6 | v52.05,28.2 v52.05,27
  Bottom 0.15: v28.5,6 28.5,7.2 23.7,12 23.7,23.4 25.8,25.5 50.7,25.5 52.05,26.85 v52.05,27 | R5.1 60.55,28.25 60.15,28.65 52.5,28.65 v52.05,28.2
N$1  (via drill 0.2)
  Top 0.15: R8.1 v33.8,5.25 | LED2.A v33.8,3.52
  Bottom 0.15: v33.8,5.25 v33.8,3.52
N$2  (via drill 0.2)
  Top 0.4: L12.1 16.77,26.67 v16.8,26.7 v17.25,26.7
  Bottom 0.4: IC5.7 16.45,26.46 16.65,26.67 17.22,26.67 v17.25,26.7
N$3
  Bottom 0.3: Q2.3 71.65,22.89 RGQ1_2.1
N$4
  Bottom 0.3: V+R.1 62.24,7.81 L7.2
N$5  (via drill 0.2)
  Top 0.15: R2.1 v35.3,5.25 | LED1.A v35.3,3.52
  Bottom 0.15: v35.3,5.25 v35.3,3.52
N$6  (via drill 0.2)
  Top 0.4: L12.2 16.78,27.92 v16.8,27.9 v17.25,27.9
  Bottom 0.4: IC5.6 16.46,27.73 16.65,27.92 17.23,27.92 v17.25,27.9
Q1G
  Bottom 0.3: Q1.1 69.99,18.86 RGQ1_1.2 73.69,18.86 D2.A 73.89,22.15 RGQ1_2.2
QBG1  (via drill 0.2)
  Top 0.25: QB1.1 v34.45,10.5
  Bottom 0.25: RBG1.1 v34.45,10.5
QBG2  (via drill 0.2)
  Top 0.25: QB2.1 v38.2,10.5
  Bottom 0.25: RBG2.1 v38.2,10.5
QBG3  (via drill 0.2)
  Top 0.25: QB3.1 v41.95,10.5
  Bottom 0.25: RBG3.1 v41.95,10.5
QBG4  (via drill 0.2)
  Top 0.25: QB4.1 v45.7,10.5
  Bottom 0.25: RBG4.1 v45.7,10.5
QBG5  (via drill 0.2)
  Top 0.25: QB5.1 v49.45,10.5
  Bottom 0.25: RBG5.1 v49.45,10.5
QBG6  (via drill 0.2)
  Top 0.25: QB6.1 v53.2,10.5
  Bottom 0.25: RBG6.1 v53.2,10.5
QBG7  (via drill 0.2)
  Top 0.25: QB7.1 v56.95,10.5
  Bottom 0.25: RBG7.1 v56.95,10.5
QBG8  (via drill 0.2)
  Top 0.25: QB8.1 v60.7,10.5
  Bottom 0.25: RBG8.1 v60.7,10.5
QBG9  (via drill 0.2)
  Top 0.25: QB9.1 v64.45,10.5
  Bottom 0.25: RBG9.1 v64.45,10.5
QBG10  (via drill 0.2)
  Top 0.25: QB10.1 v68.2,10.5
  Bottom 0.25: RBG10.1 v68.2,10.5
QBG11  (via drill 0.2)
  Top 0.25: QB11.1 v71.95,10.5
  Bottom 0.25: RBG11.1 71.65,10.8 v71.95,10.5
QBG12  (via drill 0.2)
  Top 0.15: QB12.1 v72.25,7.5
  Bottom 0.15: RBG12.1 73.15,11.4 73.45,11.1 73.45,7.95 QB12.1 v72.25,7.5
RS1
  Bottom 0.3: R39.1 15.64,25.18 IC5.8
SCK
  Bottom 0.2: IC2.41 61.71,25.44 61.5,25.65 60.66,25.65 R3.2
SCK0  (via drill 0.2)
  Top 0.15: IC1.22 29.46,3.54 v28.5,4.5
  Bottom 0.15: v28.5,4.5 27.6,5.4 27.6,7.2 23.1,11.7 23.1,23.7 25.5,26.1 49.8,26.1 51.3,27.6 52.2,27.6 52.95,28.35 58.96,28.35 R3.1
SDI
  Bottom 0.2: IC2.42 62.21,25.69 61.8,26.1 61.23,26.1 R5.2
SDO
  Bottom 0.2: IC2.43 62.71,26.72 R19.1 R4.2
SSEL0  (via drill 0.2)
  Top 0.15: IC1.10 24.29,3.76 25.5,2.55 27,2.55 27.45,3 27.45,5.78 v27.07,6.15
  Bottom 0.15: v27.07,6.15 27.07,7.28 22.8,11.55 22.8,23.85 25.35,26.4 49.2,26.4 49.95,27.15 49.95,28.5 50.7,29.25 63,29.25 63.64,28.61 R1.1
SW1  (via drill 0.2)
  Bottom 0.3: REG5_C2.2 11.9,8.6 v12,8.7
  pour Top (no thermals): 17.88,6.03 17.88,8.07 13.53,8.07 12.6,9 12,9 10.38,7.38 10.38,6.78 15.12,6.78 15.88,6.03
SWCLK
  Top 0.15: J1.4 38.55,4.97 38.12,4.55 33.75,4.55 33.54,4.76 IC1.29
SWDIO  (via drill 0.2)
  Top 0.15: J1.3 38.55,3.55 38.15,3.95 36.5,3.95 v36.3,3.75 | IC1.39 29.46,10.74 v29.55,10.95
  Bottom 0.15: v29.55,10.95 29.55,10.05 29.9,9.7 33.5,9.7 36.3,6.9 v36.3,3.75
TEMP0  (via drill 0.2)
  Top 0.15: X1.1 v31.15,20.5 | IC1.42 27.96,10.59 v27.75,10.8
  Top 0.3: X1.1 31.69,22.54 v32.25,23.1
  Bottom 0.15: v31.15,20.5 30.9,20.25 30.9,18 27,14.1 27,11.55 v27.75,10.8
  Bottom 0.3: NTC_C3.1 31.75,23.6 v32.25,23.1 31.65,22.5 NTC_R3.1
TEMP1  (via drill 0.2)
  Top 0.15: IC1.40 28.96,12.44 v28.95,12.6 | X1.2 34.15,21.7 33.75,21.3 32.85,21.3 v32.55,21
  Top 0.3: X1.2 33.56,22.54 v33,23.1
  Bottom 0.15: v28.95,12.6 29.25,12.9 29.25,15.9 31.2,17.85 31.2,19.65 v32.55,21
  Bottom 0.3: NTC_C2.1 33.5,23.6 v33,23.1 33.6,22.5 NTC_R2.1
TEMP2  (via drill 0.2)
  Top 0.15: IC1.35 31.24,7.76 30.9,8.1 30.9,10.65 v30.15,11.4 | X1.4 39.19,22.54 v38.4,21.75
  Top 0.3: X1.4 40.15,23.05 39.6,23.6 v38.98,23.6
  Bottom 0.15: v30.15,11.4 29.55,12 29.55,15.75 31.5,17.7 31.5,19.2 33.3,21 37.65,21 v38.4,21.75
  Bottom 0.3: v38.98,23.6 NTC_C4.1 NTC_R4.1
TEMP3  (via drill 0.2)
  Top 0.15: IC1.34 32.61,7.26 32.85,7.5 32.85,8.55 32.7,8.7 31.65,8.7 31.2,9.15 31.2,11.1 v30.15,12.15 | X1.5 42.49,22.54 v41.7,21.75
  Top 0.3: X1.5 NTC_C1.1 v41.83,23.6
  Bottom 0.15: v30.15,12.15 29.85,12.45 29.85,15.6 31.8,17.55 31.8,19.05 33.45,20.7 40.65,20.7 v41.7,21.75
  Bottom 0.3: v41.83,23.6 NTC_C1.1 NTC_R1.1
TEMPR  (via drill 0.2)
  Top 0.15: IC1.33 32.71,6.76 33.15,7.2 33.15,8.7 32.85,9 31.8,9 31.5,9.3 31.5,11.55 v30.9,12.15 30.3,12.75 29.55,12.75 28.95,13.35 C3.1 28.95,14.4 R9.1 | DT1.A v33.12,16.65 | DT2.A v40.65,16.65 | DT3.A v48.12,16.68 | DT4.A 55.62,19.07 v54.9,19.8 | v52.25,22.05 52.25,23.5 51.15,24.6 49.65,24.6 49.2,24.15 49.2,23.1 48.15,22.05 47.55,22.05 v47.1,21.6 | DT5.A 63.12,19.07 v62.4,19.8 | DT6.A 70.62,19.07 69.45,20.25 64.95,20.25 64.05,21.15 64.05,24.45 63.75,24.75 61.05,24.75 60.75,24.45 v60.75,19.8
  Bottom 0.15: v30.9,12.15 30.9,14.43 v33.12,16.65 v40.65,16.65 48.1,16.65 v48.12,16.68 47.1,17.7 v47.1,21.6 | v52.25,22.05 52.65,22.05 v54.9,19.8 55.65,19.05 58.95,19.05 59.7,19.8 v60.75,19.8 v62.4,19.8
V+  (via drill 0.2)
  Top 0.15: v72.9,20.55 72.9,22.95 R59.2
  Bottom 0.15: Q1.3 67.76,19.76 68.1,20.1 72.45,20.1 v72.9,20.55
  Bottom 0.3: IC2.1 63.29,16.89 C1.1 67.09,16.89 67.76,17.56 Q1.3
V+S
  Bottom 0.3: V+R.2 68.87,5.02 70.15,6.3 73.75,6.3 74.5,7.05 74.5,16.4 D2.C 73.54,17.36 RGQ1_1.1 70.47,17.36 Q1.2
  Bottom 0.6: D1.C 59.23,6.87 61.08,5.02 V+R.2
VREF
  Bottom 0.2: IC2.31 56.71,26.66 CVREF.2
VREG
  Bottom 0.2: IC2.32 57.21,25.96 CVREG.2
XTALIN  (via drill 0.2)
  Top 0.15: IC1.6 25.14,5.76 v25.2,5.85
  Bottom 0.15: Y1.P3 25.65,3.7 25.65,4.05 | 25.65,4.05 25.65,5.4 v25.2,5.85 | C15.2 25.65,4.4 25.65,3.95 25.75,3.95 25.65,4.05
XTALOUT  (via drill 0.2)
  Top 0.15: v26.85,3.15 26.85,3.9 25.43,5.33 23.9,5.33 23.88,5.3 23.55,5.3 23.51,5.26 IC1.7
  Bottom 0.15: Y1.P1 23.67,1.28 23.67,1.77 24.52,2.62 26.32,2.62 v26.85,3.15 26.85,1.35 C14.2

### Text on the board
bValues: WE-TVS
Document: T1 | T2 | GND | T3 | T4 | C1 | C3 | C5 | C7 | C9 | C11 | GND | CANH | CANL | 12V | C0 | C2 | C4 | C6 | C8 | C10 | C12
_tsilk: LV | HV
_bsilk: LV | HV | canSlaveV05a / CC BY-NC-SA / c David Brandt / david@wakka.de | LV | HV